# Altium project PropMark.PrjPcb
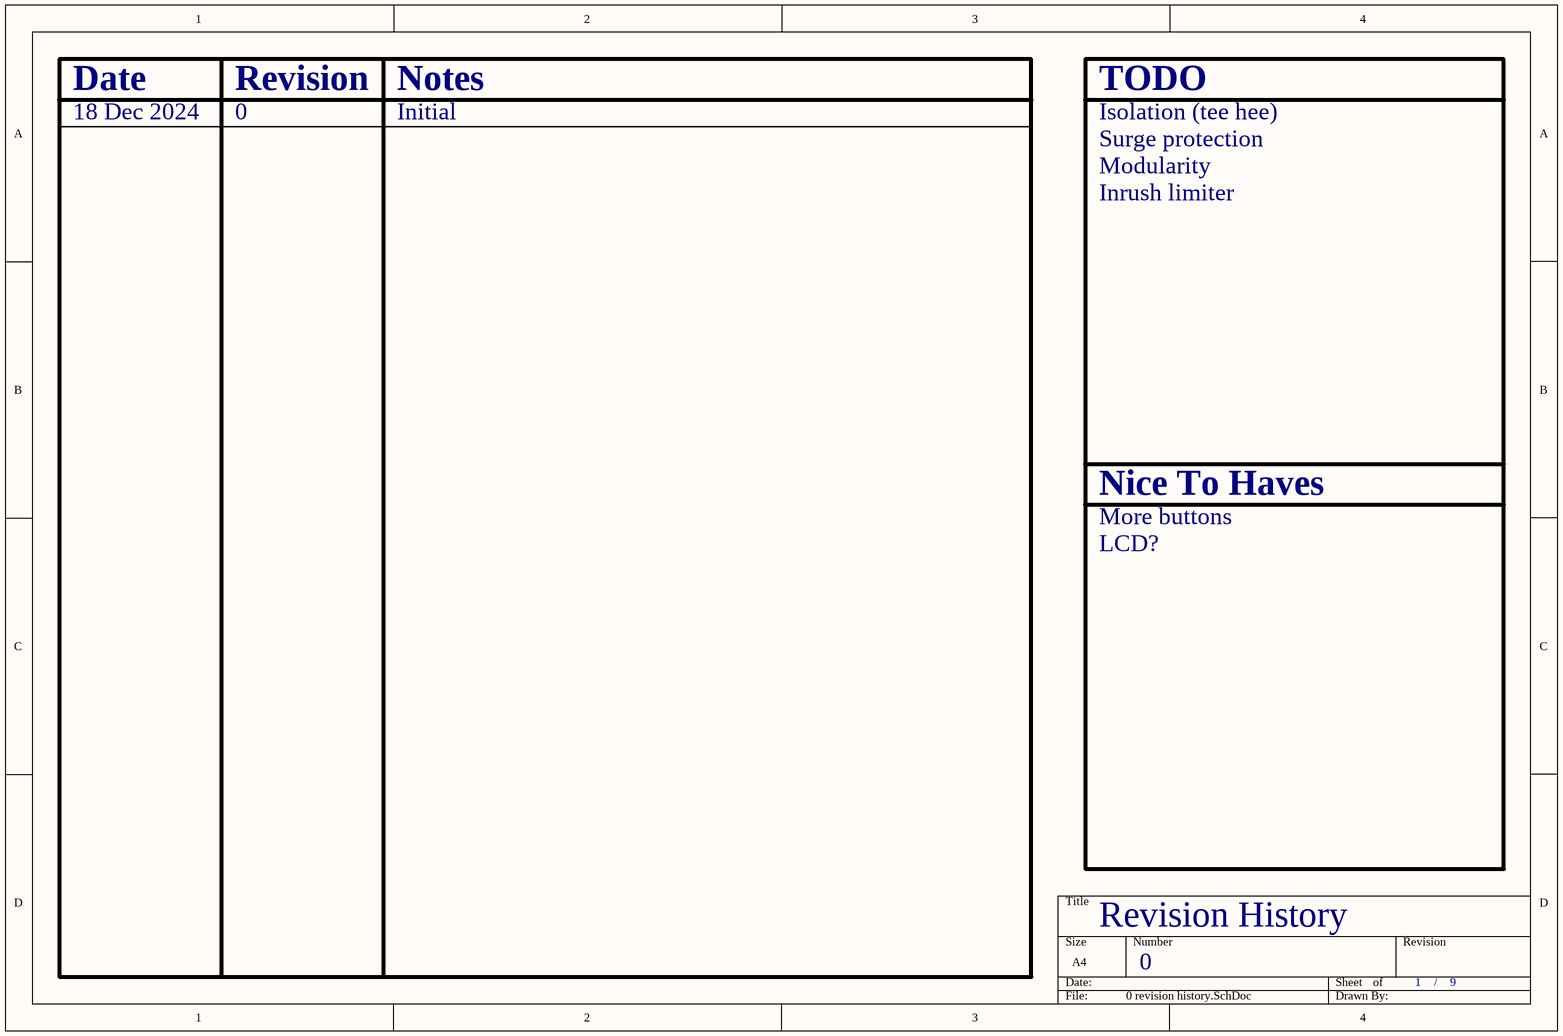
[diagram p0: 0 revision history.SchDoc]
8 sheets, 173 parts. Net scope: hierarchical (ports join the sheet entries above them; power ports are global).
Board files: main.PcbDoc, panel.PcbDoc
Sheets:
  0 revision history.SchDoc
  1 power.SchDoc
  2 main mcu.SchDoc
  3 ports.SchDoc
  4 memory.SchDoc
  5 led.SchDoc
  6 cell amplifier.SchDoc
  7 esc.SchDoc

## Sheet 0 revision history.SchDoc
size A4; DocumentNumber: 0; SheetNumber: 1; SheetTotal: 9

### Notes on the sheet
- Date
- Revision
- Notes
- TODO
- 18 Dec 2024
- 0
- Initial
- Isolation (tee hee)
- Surge protection
- Modularity
- Inrush limiter
- Nice To Haves
- More buttons
- LCD?
- Revision History
- /

## Sheet 1 power.SchDoc
size A4; DocumentNumber: 1; SheetNumber: 3; SheetTotal: 9
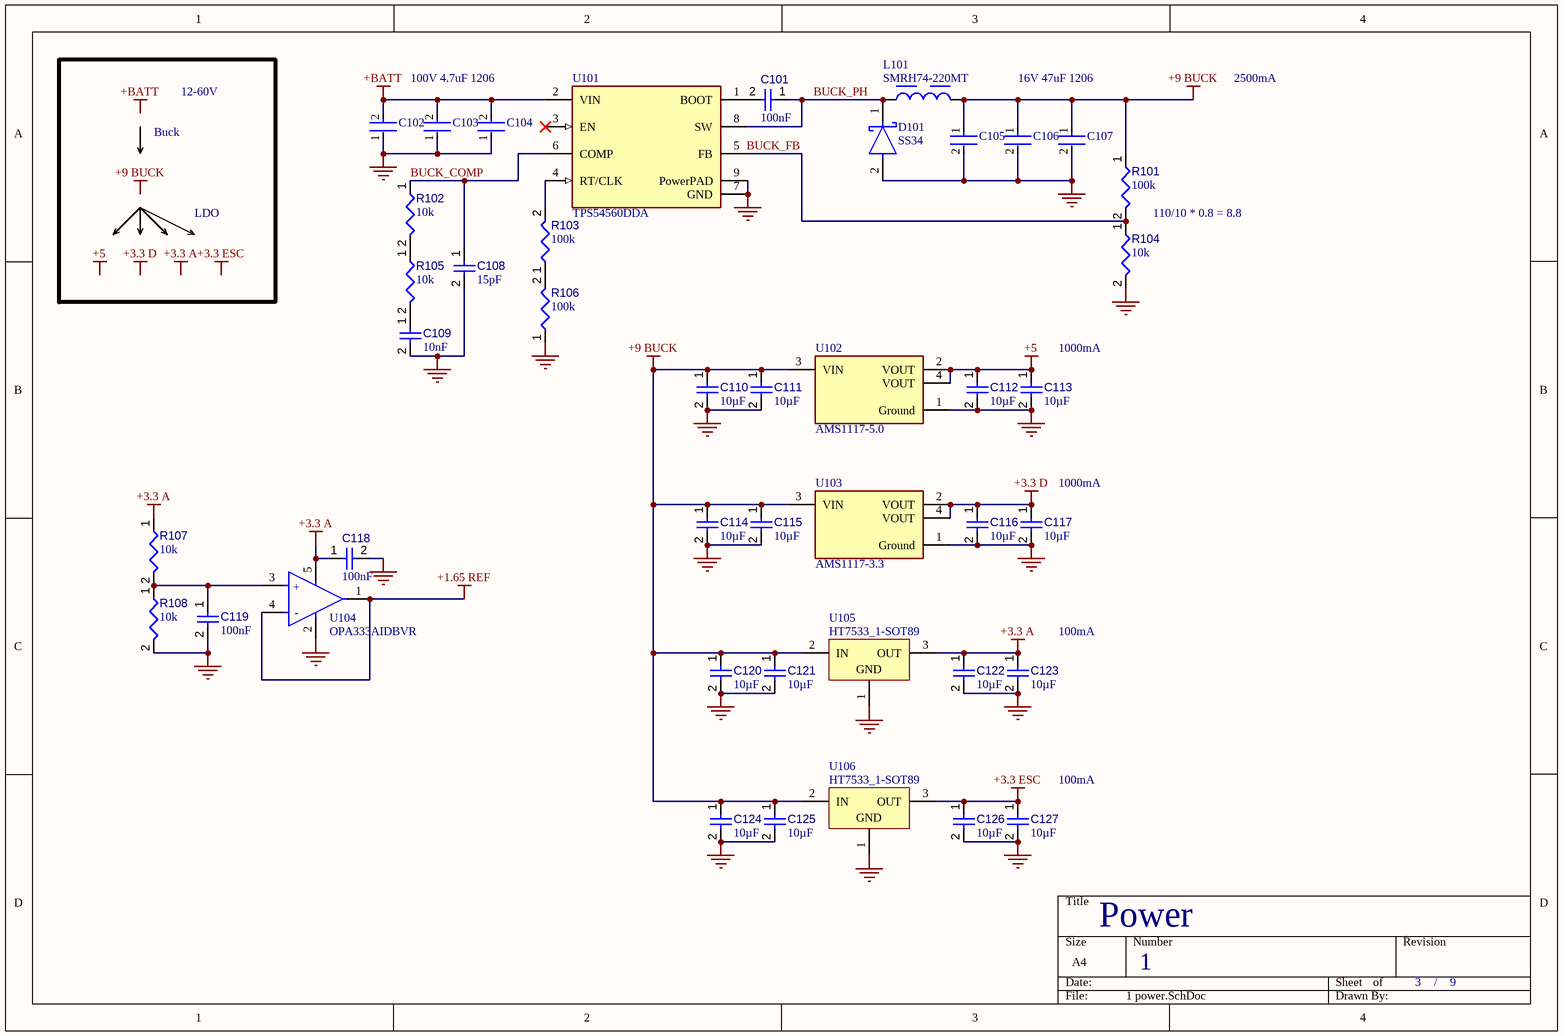
[diagram p1: 1 power.SchDoc]

### Parts
C101  value 100nF  [CAPC0402(1005)60_L]  (hidden comment: Capacitor 100nF +/-20% 25V 0402)
C102  GRM31CZ72A475KE11L  [FP-GRM31C-0_3-e0_3_0_9-MFG]  (value not drawn)
C103  GRM31CZ72A475KE11L  [FP-GRM31C-0_3-e0_3_0_9-MFG]  (value not drawn)
C104  GRM31CZ72A475KE11L  [FP-GRM31C-0_3-e0_3_0_9-MFG]  (value not drawn)
C105  C3216X5R1C476M160AB  [FP-C3216-160-0_2-MFG]  (value not drawn)
C106  C3216X5R1C476M160AB  [FP-C3216-160-0_2-MFG]  (value not drawn)
C107  C3216X5R1C476M160AB  [FP-C3216-160-0_2-MFG]  (value not drawn)
C108  value 15pF  [CAPC0402(1005)60_L]  (hidden comment: Capacitor 15pF +/-20% 50V 0402)
C109  value 10nF  [CAPC0402(1005)60_L]  (hidden comment: Capacitor 10nF +/-20% 50V 0402)
C110  value 10µF  [CAPC0603(1608)100_L]  (hidden comment: Capacitor 10µF +/-20% 10V 0603)
C111  value 10µF  [CAPC0603(1608)100_L]  (hidden comment: Capacitor 10µF +/-20% 10V 0603)
C112  value 10µF  [CAPC0603(1608)100_L]  (hidden comment: Capacitor 10µF +/-20% 10V 0603)
C113  value 10µF  [CAPC0603(1608)100_L]  (hidden comment: Capacitor 10µF +/-20% 10V 0603)
C114  value 10µF  [CAPC0603(1608)100_L]  (hidden comment: Capacitor 10µF +/-20% 10V 0603)
C115  value 10µF  [CAPC0603(1608)100_L]  (hidden comment: Capacitor 10µF +/-20% 10V 0603)
C116  value 10µF  [CAPC0603(1608)100_L]  (hidden comment: Capacitor 10µF +/-20% 10V 0603)
C117  value 10µF  [CAPC0603(1608)100_L]  (hidden comment: Capacitor 10µF +/-20% 10V 0603)
C118  value 100nF  [CAPC0402(1005)60_L]  (hidden comment: Capacitor 100nF +/-20% 25V 0402)
C119  value 100nF  [CAPC0402(1005)60_L]  (hidden comment: Capacitor 100nF +/-20% 25V 0402)
C120  value 10µF  [CAPC0603(1608)100_L]  (hidden comment: Capacitor 10µF +/-20% 10V 0603)
C121  value 10µF  [CAPC0603(1608)100_L]  (hidden comment: Capacitor 10µF +/-20% 10V 0603)
C122  value 10µF  [CAPC0603(1608)100_L]  (hidden comment: Capacitor 10µF +/-20% 10V 0603)
C123  value 10µF  [CAPC0603(1608)100_L]  (hidden comment: Capacitor 10µF +/-20% 10V 0603)
C124  value 10µF  [CAPC0603(1608)100_L]  (hidden comment: Capacitor 10µF +/-20% 10V 0603)
C125  value 10µF  [CAPC0603(1608)100_L]  (hidden comment: Capacitor 10µF +/-20% 10V 0603)
C126  value 10µF  [CAPC0603(1608)100_L]  (hidden comment: Capacitor 10µF +/-20% 10V 0603)
C127  value 10µF  [CAPC0603(1608)100_L]  (hidden comment: Capacitor 10µF +/-20% 10V 0603)
D101  SS34  [FP-SMA-MFG]
L101  SMRH74-220MT  [WE-HCI_7040]
R101  value 100k  [RESC0402(1005)_L]  (hidden comment: Resistor 100K +/-1 % 0402 63 mW)
R102  value 10k  [RESC0402(1005)_L]  (hidden comment: Resistor 10K  +/-1 % 0402 63 mW)
R103  value 100k  [RESC0402(1005)_L]  (hidden comment: Resistor 100K +/-1 % 0402 63 mW)
R104  value 10k  [RESC0402(1005)_L]  (hidden comment: Resistor 10K  +/-1 % 0402 63 mW)
R105  value 10k  [RESC0402(1005)_L]  (hidden comment: Resistor 10K  +/-1 % 0402 63 mW)
R106  value 100k  [RESC0402(1005)_L]  (hidden comment: Resistor 100K +/-1 % 0402 63 mW)
R107  value 10k  [RESC0402(1005)_L]  (hidden comment: Resistor 10K  +/-1 % 0402 63 mW)
R108  value 10k  [RESC0402(1005)_L]  (hidden comment: Resistor 10K  +/-1 % 0402 63 mW)
U101  TPS54560DDA  [FP-DDA0008E-IPC_C]
U102  AMS1117-5.0  [FP-AMS1117-IPC_C]
U103  AMS1117-3.3  [FP-AMS1117-IPC_C]
U104  OPA333AIDBVR  [FP-DBV0005A-MFG]
U105  HT7533_1-SOT89  [SOT89_L]
U106  HT7533_1-SOT89  [SOT89_L]

### Nets
+1.65 REF: U104.1(OUT) U104.4(-IN)
+3.3 A: C118.1 C122.1 C123.1 R107.1 U104.5(V+) U105.3(OUT)
+3.3 D: C116.1 C117.1 U103.2(VOUT) U103.4(VOUT)
+3.3 ESC: C126.1 C127.1 U106.3(OUT)
+5: C112.1 C113.1 U102.2(VOUT) U102.4(VOUT)
+9 BUCK: C105.1 C106.1 C107.1 C110.1 C111.1 C114.1 C115.1 C120.1 C121.1 C124.1 C125.1 L101.2 R101.1 U102.3(VIN) U103.3(VIN) U105.2(IN) U106.2(IN)
+BATT: C102.2 C103.2 C104.2 U101.2(VIN)
GND: C102.1 C103.1 C104.1 C105.2 C106.2 C107.2 C108.2 C109.2 C110.2 C111.2 C112.2 C113.2 C114.2 C115.2 C116.2 C117.2 C118.2 C119.2 C120.2 C121.2 C122.2 C123.2 C124.2 C125.2 C126.2 C127.2 D101.2(A) R104.2 R106.1 R108.2 U101.7(GND) U101.9(PowerPAD) U102.1(Ground) U103.1(Ground) U104.2(V-) U105.1(GND) U106.1(GND)
BUCK_COMP: C108.1 R102.1 U101.6(COMP)
BUCK_FB: R101.2 R104.1 U101.5(FB)
BUCK_PH: C101.1 D101.1(C) L101.1 U101.8(SW)
NetC101_2: C101.2 U101.1(BOOT)
NetC109_1: C109.1 R105.2
NetC119_1: C119.1 R107.2 R108.1 U104.3(+IN)
NetR102_2: R102.2 R105.1
NetR103_1: R103.1 R106.2
NetR103_2: R103.2 U101.4(RT/CLK)

Not connected (* = marked no-connect by the designer): U101 3(EN)*

### Notes on the sheet
- 12-60V
- 100V 4.7uF 1206
- 16V 47uF 1206
- 2500mA
- Buck
- LDO
- 110/10 * 0.8 = 8.8
- (near C113) 1000mA
- (near C117) 1000mA
- (near C123) 100mA
- (near C127) 100mA
- Power
- /
- Labels drawn without touching a wire or pin: +3.3 A, +3.3 D, +3.3 ESC, +5, +9 BUCK, +BATT
- (in symbol CMP-0272-00862-4) +; -

### Library data of the parts
C101 C118 C119 = CMP-001-00065-4: Chip Capacitor, 100nF +/-20%, 25V, 0402, Thickness 0.6 mm; Tolerance: 10%; Max Operating Temperature: 85°C; Min Operating Temperature: -55°C; Pins: 2; Voltage Rating: 25V; Mounting Technology: SMT; Case/Package: 0402
C102-C104 = CMP-06035-056253-1: Chip Multilayer Ceramic Capacitors for General Purpose, 1206, 4.7uF, X7R, 15%, 10%, 100V
C105-C107 = CMP-2000-07442-2: Multilayer Ceramic Capacitors 47uF ±20% 16V X5R SMD 1206; Resistor Type: Ceramic; Width: 0.063inch; Case Code (Imperial): 1206; Radiation Hardening: No; Thickness: 0.071inch; Dielectric: X5R; Weight: 0.000571oz; Termination: SMD/SMT; Dielectric Material: Ceramic; Min Operating Temperature: -55°C; Depth: 1.6mm; Case Code (Metric): 3216; Max Operating Temperature: 85°C; RoHS Compliant: Yes; REACH SVHC: No SVHC; Mount: Surface Mount; Lead Free: Lead Free; Height: 1.6mm; Length: 3.2mm; Tolerance: 20%; Voltage Rating (DC): 16V; Capacitance: 47uF; Package Quantity: 1; Construction: Flat; Packaging: Tape and Reel; Series: C; Case/Package: 1206; Voltage Rating: 16V
C108 = CMP-001-00069-3: Chip Capacitor, 15pF +/-20%, 50V, 0402, Thickness 0.6 mm; Tolerance: 5%; Max Operating Temperature: 85°C; Pins: 2; Case/Package: 0402; Voltage Rating: 50V; Min Operating Temperature: -55°C; Mounting Technology: SMT; JLCPCB Part #: C1548
C109 = CMP-001-00069-3: Chip Capacitor, 10nF +/-20%, 50V, 0402, Thickness 0.6 mm; Tolerance: 5%; Max Operating Temperature: 85°C; Pins: 2; Case/Package: 0402; Voltage Rating: 50V; Min Operating Temperature: -55°C; Mounting Technology: SMT; JLCPCB Part #: C15195
C110-C117 C120-C127 = CMP-001-00075-4: Chip Capacitor, 10µF +/-20%, 10V, 0603, Thickness 1 mm; Tolerance: 10%; Voltage Rating: 10V; Max Operating Temperature: 85°C; Pins: 2; Case/Package: 0603; Mounting Technology: SMT; Min Operating Temperature: -55°C
D101 = CMP-1667-00003-3: DIODE SCHOTTKY 40V 3A SMA; Max Forward Surge Current (Ifsm): 80A; Forward Voltage: 500mV; Polarity: Standard; Max Reverse Current: 500uA; Capacitance: 250pF; Element Configuration: Single; Mount: Surface Mount; Output Current: 3A; Radiation Hardening: No; Width: 2.92mm; Current Rating: 3A; Termination: SMD/SMT; Voltage: 40V; Series: -; Max Operating Temperature: 125°C; Current: 3A; Max Repetitive Reverse Voltage (Vrrm): 40V; Min Operating Temperature: -55°C; REACH SVHC: No SVHC; Number of Pins: 2; Average Rectified Current: 3A; Contact Plating: Tin; RoHS Compliant: Yes; Max Reverse Voltage (DC): 40V; Packaging: Tape and Reel; Height: 2.3mm; Length: 4.6mm; Case/Package: SMA; Weight: 0.002258oz; Peak Non-Repetitive Surge Current: 80A; Package Quantity: 5000; Lead Free: Lead Free; Forward Current: 3A; Voltage Rating (DC): 40V
L101 = CMP-0226-00071-2: NexarPartId: 7864301; Max DC Current: 6A; Series Resistance: 19.5Ω; Shielding: Shielded; DC Resistance (DCR): 19.5mΩ; Inductance: 4.7µH; Tolerance: 20%; Test Frequency: 100kHz; Self Resonant Frequency: 33MHz; Saturation Current: 7A; Height - Seated (Max): 3.9878mm; Height: 3.8mm; Packaging: Cut Tape (CT); REACH SVHC: Unknown; Width: 6.9mm; Mount: Surface Mount; Termination: SMD/SMT; Composition: Wirewound; Depth: 6.9mm; Ambient Temperature Range High: 100°C; Lead Free: Lead Free; Current Rating: 6A; Length: 7mm; RMS Current (Irms): 6A; Ambient Temperature Range Low: -40°C; Number of Pins: 2; Case/Package: Nonstandard; Min Operating Temperature: -40°C; RoHS: Compliant; Resistance: 19.5mΩ; Max Operating Temperature: 150°C; Inductance Tolerance: 20%
R101 R103 R106 = CMP-009-00168-3: Chip Resistor, 100 kOhms, +/-1 %, 63 mW, -55 to 155 degC, 0402; Tolerance: 1%; Power: 63mW; Max Operating Temperature: 155°C; Min Operating Temperature: -55°C; Pins: 2; Case/Package: 0402
R102 R104 R105 R107 R108 = CMP-009-00149-3: Chip Resistor, 10 kOhms, +/-1 %, 63 mW, -55 to 125 degC, 0402; Power: 63mW; Tolerance: 1%; Min Operating Temperature: -55°C; Case/Package: 0402; Max Operating Temperature: 155°C; Pins: 2
U101 = CMP-04918-000033-1: IC REG BCK SPLIT RAIL ADJ 8SOPWR; Manufacturer: Texas Instruments; Min Supply Voltage: 4.5V; Switching Topology: Buck; Max Junction Temp: +150°C; Max Duty Cycle: 100%; Standoff Height: 0mm; Output Type: AdjustableProgrammable; Output Voltage: 0.8-58.8V; Output Current: 5A; Number Of Outputs: 1; Switching Frequency: 100-2500kHz; Max Supply Voltage: 60V; Nominal Supply Current: 146uA; Octopart: https://octopart.com/tps54560dda-texas+instruments-26977150; Temperature: -40°C to +125°C; ComponentLink2Description: Datasheet; Category: IC; Mouser Description: Voltage Regulators - Switching Regulators 60V Input 5 A SD DC-DC Cnvtr; Automotive: No; Ipc Land Pattern Name: SOIC127P600X170-8; Height: 1.7mm; RoHS: TRUE; ComponentLink2URL: http://www.ti.com/lit/ds/symlink/tps54560.pdf; Device Class L3: Voltage Regulators - Switching; Temperature Range High: +125°C; Device Class L2: Power Management ICs; Package: DDA0008E; Lead Free: Yes; Digikey Description: IC REG BCK SPLIT RAIL ADJ 8SOPWR; Device Class L1: Integrated Circuits (ICs); Manufacturer Part Number: TPS54560DDA; Temperature Range Low: -40°C
U102 = CMP-209535-000001-1: LDO Voltage Regulators 1A, 5.0V; Manufacturer: Advanced Monolithic Systems; Dropout Voltage: 1.1V; Output Type: Fixed; Nominal Supply Current: 5mA; Output Voltage: 3.3V; Max Power Dissipation: 1.2W; Max Supply Voltage: 15V; Number Of Outputs: 1; Standoff Height: 0.64mm; Max Junction Temp: +125°C; Height: 1.8mm; Package: AMS1117; Device Class L2: Power Management ICs; ComponentLink2Description: Datasheet; ComponentLink2URL: http://www.advanced-monolithic.com/pdf/ds1117.pdf; Category: IC; RoHS: TRUE; Automotive: No; Device Class L1: Integrated Circuits (ICs); Output Current: 1A; Device Class L3: Voltage Regulators - Linear; Temperature: -40°C to +125°C; Manufacturer Part Number: AMS1117-5.0; Temperature Range Low: -40°C; Lead Free: Yes; Ipc Land Pattern Name: SOT229P700X180-4; Temperature Range High: +125°C; JLCPCB Part #: C6187
U103 = CMP-209535-000001-1: LDO Voltage Regulators 1A, 3.3V; Manufacturer: Advanced Monolithic Systems; Dropout Voltage: 1.1V; Output Type: Fixed; Nominal Supply Current: 5mA; Max Power Dissipation: 1.2W; Max Supply Voltage: 15V; Number Of Outputs: 1; Standoff Height: 0.64mm; Max Junction Temp: +125°C; Height: 1.8mm; Package: AMS1117; Device Class L2: Power Management ICs; ComponentLink2Description: Datasheet; ComponentLink2URL: http://www.advanced-monolithic.com/pdf/ds1117.pdf; Category: IC; RoHS: TRUE; Automotive: No; Device Class L1: Integrated Circuits (ICs); Output Current: 1A; Device Class L3: Voltage Regulators - Linear; Temperature: -40°C to +125°C; Output Voltage: 3.3V; Manufacturer Part Number: AMS1117-3.3; Temperature Range Low: -40°C; Octopart: https://octopart.com/ams1117-3.3-advanced+monolithic+systems-25899300; Lead Free: Yes; Ipc Land Pattern Name: SOT229P700X180-4; Temperature Range High: +125°C; JLCPCB Part #: C6186
U104 = CMP-0272-00862-4: IC OPAMP ZER-DRIFT 1CIRC SOT23-5; Number of Elements: 1; Common Mode Rejection Ratio: 106dB; Max Supply Voltage: 5.5V; Min Supply Voltage: 1.8V; Max I/O Voltage: 10uV; Output Current per Channel: 5mA; Max Dual Supply Voltage: 2.75V; Operating Supply Current: 17uA; Nominal Supply Current: 25uA; Bandwidth: 350kHz; Min Dual Supply Voltage: 900mV; Power Supply Rejection Ratio (PSRR): 120dB; Voltage Gain: 130dB; Input Bias Current: 200pA; Slew Rate: 0.16V/µs; Number of Channels: 1; Max Operating Temperature: 125°C; REACH SVHC: No SVHC; Number of Amplifiers: 1; Input Offset Voltage (Vos): 10uV; Radiation Hardening: No; Lead Free: Lead Free; Operating Supply Voltage: 2.75V; Min Operating Temperature: -40°C; Contact Plating: Gold; Number of Pins: 5; Output Current: 5mA; Packaging: Tape and Reel; Unity Gain Bandwidth Product: 350kHz; Number of Circuits: 1; Gain Bandwidth Product: 350kHz; Case/Package: SOT-23-5; Package Quantity: 1
U105 U106 = CMP-0204-00101-1: 100mA Low Power LDO, Output Voltage 3.3V, SOT89 Pkg; DatasheetVersion: Rev1.80, Mar-2010; PackageDescription: 3-Pin SOT-89 Package 1.5 mm Pitch, 4.1 mm Lead Span; PackageReference: SOT89; PackageVersion: May-2010; Code_IPC: SOT89

## Sheet 2 main mcu.SchDoc
size A4; DocumentNumber: 2; SheetNumber: 4; SheetTotal: 9
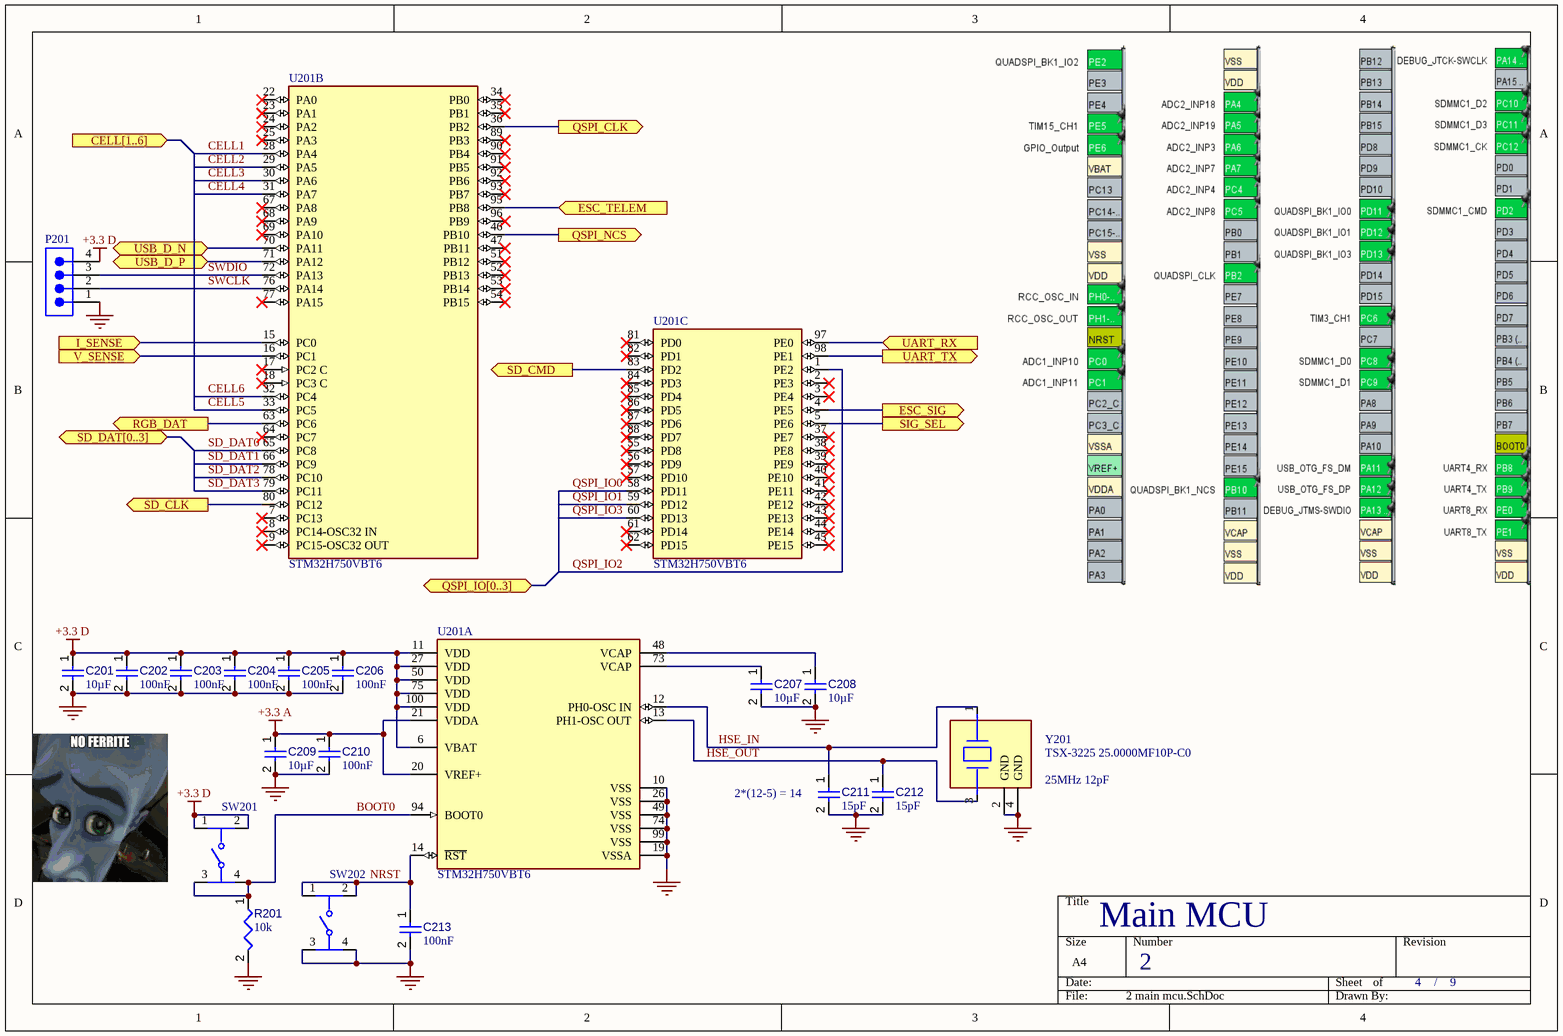
[diagram p2: 2 main mcu.SchDoc]

### Parts
C201  value 10µF  [CAPC0603(1608)100_L]  (hidden comment: Capacitor 10µF +/-20% 10V 0603)
C202  value 100nF  [CAPC0402(1005)60_L]  (hidden comment: Capacitor 100nF +/-20% 25V 0402)
C203  value 100nF  [CAPC0402(1005)60_L]  (hidden comment: Capacitor 100nF +/-20% 25V 0402)
C204  value 100nF  [CAPC0402(1005)60_L]  (hidden comment: Capacitor 100nF +/-20% 25V 0402)
C205  value 100nF  [CAPC0402(1005)60_L]  (hidden comment: Capacitor 100nF +/-20% 25V 0402)
C206  value 100nF  [CAPC0402(1005)60_L]  (hidden comment: Capacitor 100nF +/-20% 25V 0402)
C207  value 10µF  [CAPC0603(1608)100_L]  (hidden comment: Capacitor 10µF +/-20% 10V 0603)
C208  value 10µF  [CAPC0603(1608)100_L]  (hidden comment: Capacitor 10µF +/-20% 10V 0603)
C209  value 10µF  [CAPC0603(1608)100_L]  (hidden comment: Capacitor 10µF +/-20% 10V 0603)
C210  value 100nF  [CAPC0402(1005)60_L]  (hidden comment: Capacitor 100nF +/-20% 25V 0402)
C211  value 15pF  [CAPC0402(1005)60_L]  (hidden comment: Capacitor 15pF +/-20% 50V 0402)
C212  value 15pF  [CAPC0402(1005)60_L]  (hidden comment: Capacitor 15pF +/-20% 50V 0402)
C213  value 100nF  [CAPC0402(1005)60_L]  (hidden comment: Capacitor 100nF +/-20% 25V 0402)
P201  61300411121  [61300411121]  (value not drawn)
R201  value 10k  [RESC0402(1005)_L]  (hidden comment: Resistor 10K  +/-1 % 0402 63 mW)
SW201  PTS810SJM250SMTRLFS  [FP-PTS810SJM250SMTRLFS-MFG]  (value not drawn)
SW202  PTS810SJM250SMTRLFS  [FP-PTS810SJM250SMTRLFS-MFG]  (value not drawn)
U201  STM32H750VBT6  [FP-LQFP100-1L-MFG]  (parts A,B,C of 3)
Y201  TSX-3225 25.0000MF10P-C0  [FP-TSX-3225-MFG]

### Ports
CELL[1..6] (in), ESC_SIG (out), ESC_TELEM (in), I_SENSE (in), QSPI_CLK (out), QSPI_IO[0..3] (bidir), QSPI_NCS (out), RGB_DAT (out), SD_CLK (out), SD_CMD (out), SD_DAT[0..3] (bidir), SIG_SEL (out), UART_RX (in), UART_TX (out), USB_D_N (bidir), USB_D_P (bidir), V_SENSE (in)

### Nets
+3.3 A: C209.1 C210.1 U201.20(VREF+) U201.21(VDDA)
+3.3 D: C201.1 C202.1 C203.1 C204.1 C205.1 C206.1 P201.4 SW201.1 SW201.2 U201.6(VBAT) U201.11(VDD) U201.27(VDD) U201.50(VDD) U201.75(VDD) U201.100(VDD)
GND: C201.2 C202.2 C203.2 C204.2 C205.2 C206.2 C207.2 C208.2 C209.2 C210.2 C211.2 C212.2 C213.2 P201.1 R201.2 SW202.3 SW202.4 U201.10(VSS) U201.19(VSSA) U201.26(VSS) U201.49(VSS) U201.74(VSS) U201.99(VSS) Y201.2(GND) Y201.4(GND)
BOOT0: R201.1 SW201.3 SW201.4 U201.94(BOOT0)
CELL1: U201.28(PA4)
CELL2: U201.29(PA5)
CELL3: U201.30(PA6)
CELL4: U201.31(PA7)
CELL5: U201.33(PC5)
CELL6: U201.32(PC4)
HSE_IN: C211.1 U201.12(PH0-OSC_IN) Y201.1
HSE_OUT: C212.1 U201.13(PH1-OSC_OUT) Y201.3
NRST: C213.1 SW202.1 SW202.2 U201.14(~{RST})
QSPI_IO0: U201.58(PD11)
QSPI_IO1: U201.59(PD12)
QSPI_IO2: U201.1(PE2)
QSPI_IO3: U201.60(PD13)
SD_DAT0: U201.65(PC8)
SD_DAT1: U201.66(PC9)
SD_DAT2: U201.78(PC10)
SD_DAT3: U201.79(PC11)
SWCLK: P201.2 U201.76(PA14)
SWDIO: P201.3 U201.72(PA13)
NetC207_1: C207.1 U201.73(VCAP)
NetC208_1: C208.1 U201.48(VCAP)
NetU201_4: U201.4(PE5) ; port ESC_SIG
NetU201_5: U201.5(PE6) ; port SIG_SEL
NetU201_15: U201.15(PC0) ; port I_SENSE
NetU201_16: U201.16(PC1) ; port V_SENSE
NetU201_36: U201.36(PB2) ; port QSPI_CLK
NetU201_46: U201.46(PB10) ; port QSPI_NCS
NetU201_63: U201.63(PC6) ; port RGB_DAT
NetU201_70: U201.70(PA11) ; port USB_D_N
NetU201_71: U201.71(PA12) ; port USB_D_P
NetU201_80: U201.80(PC12) ; port SD_CLK
NetU201_83: U201.83(PD2) ; port SD_CMD
NetU201_95: U201.95(PB8) ; port ESC_TELEM
NetU201_97: U201.97(PE0) ; port UART_RX
NetU201_98: U201.98(PE1) ; port UART_TX

Not connected (* = marked no-connect by the designer): U201 2(PE3)* 3(PE4)* 7(PC13)* 8(PC14-OSC32_IN)* 9(PC15-OSC32_OUT)* 17(PC2_C)* 18(PC3_C)* 22(PA0)* 23(PA1)* 24(PA2)* 25(PA3)* 34(PB0)* 35(PB1)* 37(PE7)* 38(PE8)* 39(PE9)* 40(PE10)* 41(PE11)* 42(PE12)* 43(PE13)* 44(PE14)* 45(PE15)* 47(PB11)* 51(PB12)* 52(PB13)* 53(PB14)* 54(PB15)* 55(PD8)* 56(PD9)* 57(PD10)* 61(PD14)* 62(PD15)* 64(PC7)* 67(PA8)* 68(PA9)* 69(PA10)* 77(PA15)* 81(PD0)* 82(PD1)* 84(PD3)* 85(PD4)* 86(PD5)* 87(PD6)* 88(PD7)* 89(PB3)* 90(PB4)* 91(PB5)* 92(PB6)* 93(PB7)* 96(PB9)*

### Notes on the sheet
- (near Y201) 25MHz 12pF
- (near C211) 2*(12-5) = 14
- Main MCU
- /

### Library data of the parts
C201 C207-C209 = CMP-001-00075-4: as C110 on sheet 1 power; Voltage Rating: 10V; Max Operating Temperature: 85°C; Pins: 2; Case/Package: 0603; Mounting Technology: SMT; Min Operating Temperature: -55°C
C202-C206 C210 C213 = CMP-001-00065-4: as C101 on sheet 1 power; Max Operating Temperature: 85°C; Min Operating Temperature: -55°C; Pins: 2; Voltage Rating: 25V; Mounting Technology: SMT; Case/Package: 0402
C211 C212 = CMP-001-00069-3: as C108 on sheet 1 power; Max Operating Temperature: 85°C; Pins: 2; Case/Package: 0402; Voltage Rating: 50V; Min Operating Temperature: -55°C; Mounting Technology: SMT; JLCPCB Part #: C1548
P201 = CMP-1502-01064-3: NexarPartId: 32855522; Operating Supply Voltage: 250V; Pitch: 2.54mm; Contact Resistance: 20mΩ; Number of Positions: 4; Current Rating: 3A; Connector Type: Male Pin; Gender: Male; Contact Plating: Gold; Height: 8.89mm; Lead Pitch: 2.54mm; Lead Free: Lead Free; Contact Mating Length: 5.9944mm; Number of Rows: 1; Termination: Solder; Packaging: Bulk; REACH SVHC: Unknown; Min Operating Temperature: -40°C; RoHS: Compliant; Number of Contacts: 4; Voltage Rating: 250V; Color: Black; Max Operating Temperature: 105°C; Contact Material: Copper; Mount: Through Hole; Orientation: Vertical; Number of Pins: 4
R201 = CMP-009-00149-3: as R102 on sheet 1 power; Min Operating Temperature: -55°C; Case/Package: 0402; Max Operating Temperature: 155°C; Pins: 2
SW201 SW202 = CMP-10040-000001-2: SWITCH TACTILE SPST-NO 0.05A 16V; Throw Configuration: SPST; Operating Force: 160gf; Actuator Type: Standard; Switch Travel: 0.15mm; Switch Function: Off-Mom; Max Current Rating: 50mA; Mechanical Life: 150000Cycles; Illumination Type: Non-Illuminated; Package Quantity: 2900; Depth: 4.6mm; Mount: Surface Mount; Packaging: Tape and Reel; Length: 3.2mm; RoHS Compliant: Yes; Case/Package: SMD/SMT; Voltage Rating (DC): 16V; Min Operating Temperature: -40°C; Termination: J-Bend; Lead Free: Lead Free; Contact Plating: Silver; Orientation: Straight; Max Operating Temperature: 85°C; Current Rating: 50mA; Color: Black
U201 = CMP-12105-000017-1: IC MCU 32BIT 128KB FLASH 100LQFP; Manufacturer: STMicroelectronics; Number Of Uart Channels: 9; Number Of I/Os: 82; Max Junction Temp: +125°C; Data Bus Width: 32bits; Ram Size: 1MBytes; Min Supply Voltage: 1.62V; Number Of Spi Channels: 6; Number Of Adc Channels: 36; Max Supply Voltage: 3.6V; Standoff Height: 0.05mm; Interface: I2C,SPI,UART,USART,CAN,USB,LIN,IrDA,Ethernet,I2S,Other; Number Of A/D Converters: 3; Number Of I2C Channels: 4; Memory Size: 128KBytes; Frequency: 480MHz; Number Of Timers/Counters: 20; Number Of Ethernet Channels: 1; Core Architecture: ARM Cortex-M7; Number Of Usb Channels: 2; Number Of Pwm Channels: 42; Ambient Temperature Range High: +85°C; Temperature: -40°C to +125°C; ComponentLink2URL: https://www.st.com/resource/en/datasheet/stm32h750vb.pdf; Device Class L2: Embedded Processors and Controllers; Temperature Range Low: -40°C; Octopart: https://octopart.com/stm32h750vbt6-stmicroelectronics-94048547; Category: IC; Manufacturer Part Number: STM32H750VBT6; Height: 1.6mm; Lead Free: Yes; Device Class L1: Integrated Circuits (ICs); Digikey Description: IC MCU 32BIT 128KB FLASH 100LQFP; RoHS: TRUE; Ambient Temperature Range Low: -40°C; Device Class L3: Microcontrollers; ComponentLink2Description: Datasheet; Mouser Description: MCU 32-Bit STM32H750VB ARM Cortex M7 RISC 128KB Flash 1.8V/2.5V/3.3V 100-Pin LQFP Tray; Number Of Cores: 1; Automotive: No; Memory Type: FLASH; Package: LQFP100-1L; Temperature Range High: +125°C
Y201 = CMP-36405-000019-1: CRYSTAL 25.0000MHZ 18PF SMD; ESR (Equivalent Series Resistance): 40R; Frequency Stability: 10ppm; Frequency: 25MHz; Max Operating Temperature: 85°C; Length: 3.2mm; Packaging: Tape and Reel; Min Operating Temperature: -20°C; Depth: 2.5mm; Case/Package: SMD/SMT; Load Capacitance: 18pF; Number of Pins: 4

## Sheet 3 ports.SchDoc
size A4; DocumentNumber: 3; SheetNumber: 5; SheetTotal: 9
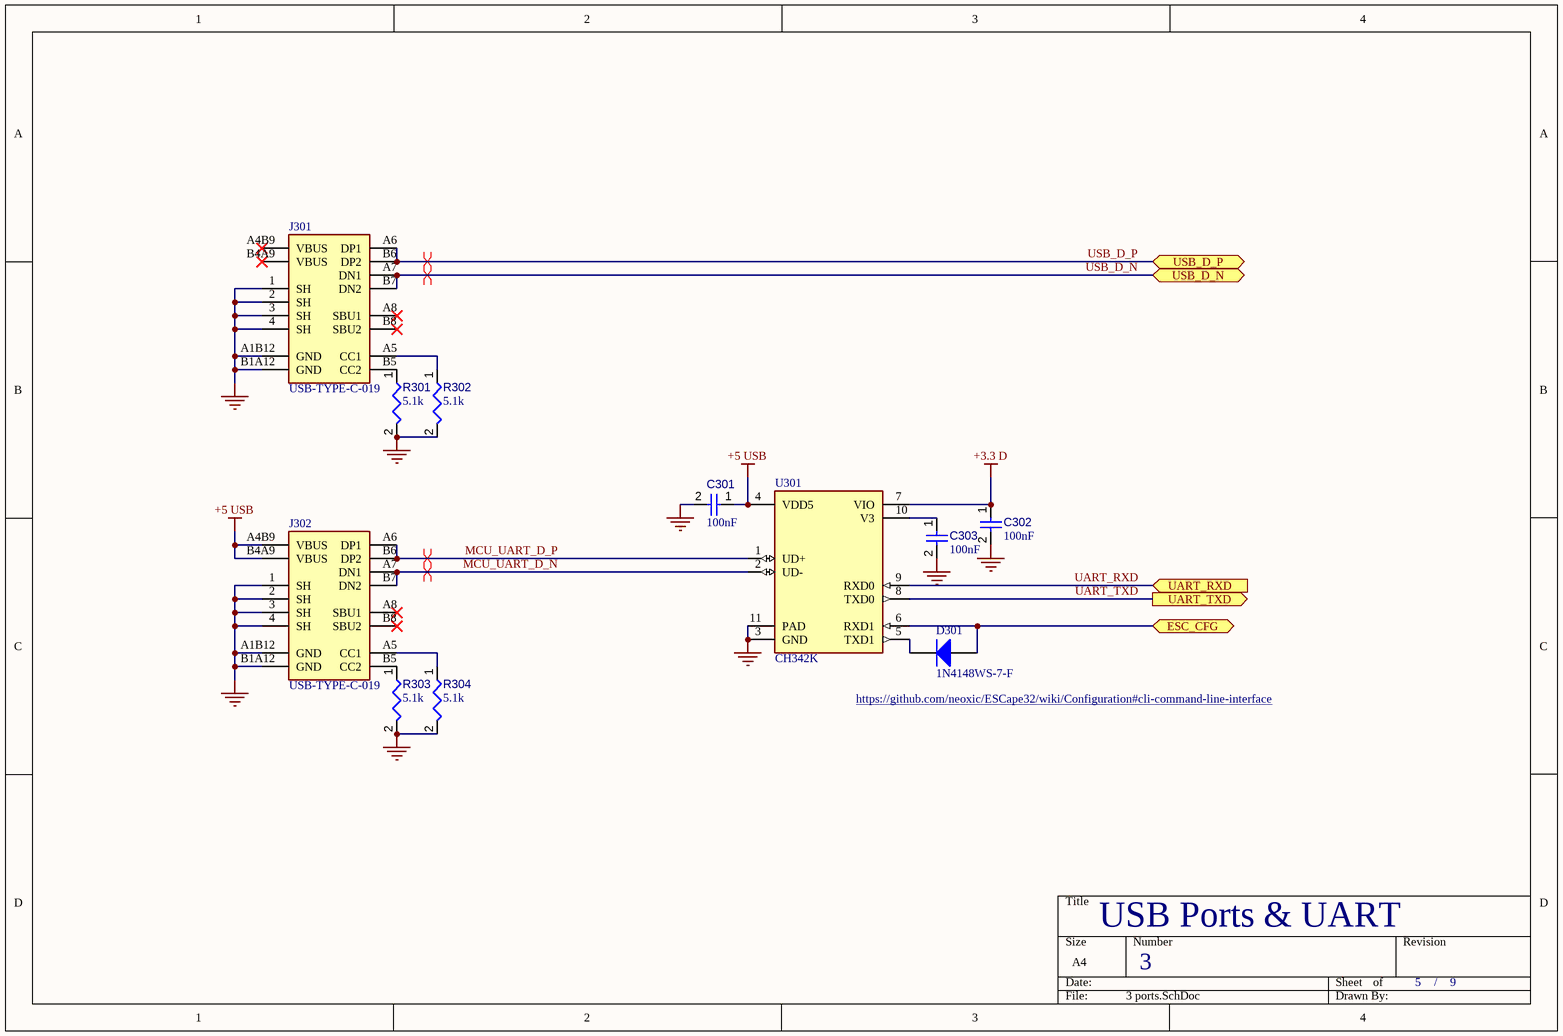
[diagram p3: 3 ports.SchDoc]

### Parts
C301  value 100nF  [CAPC0402(1005)60_L]  (hidden comment: Capacitor 100nF +/-20% 25V 0402)
C302  value 100nF  [CAPC0402(1005)60_L]  (hidden comment: Capacitor 100nF +/-20% 25V 0402)
C303  value 100nF  [CAPC0402(1005)60_L]  (hidden comment: Capacitor 100nF +/-20% 25V 0402)
D301  1N4148WS-7-F  [DIOD-SOD323-2-A_V]
J301  USB-TYPE-C-019  [USB-TYPE-C-12+4P]
J302  USB-TYPE-C-019  [USB-TYPE-C-12+4P]
R301  value 5.1k  [RESC0402(1005)_L]  (hidden comment: Resistor 5K1  +/-1 % 0402 63 mW)
R302  value 5.1k  [RESC0402(1005)_L]  (hidden comment: Resistor 5K1  +/-1 % 0402 63 mW)
R303  value 5.1k  [RESC0402(1005)_L]  (hidden comment: Resistor 5K1  +/-1 % 0402 63 mW)
R304  value 5.1k  [RESC0402(1005)_L]  (hidden comment: Resistor 5K1  +/-1 % 0402 63 mW)
U301  CH342K  [SSOP-10_L5.0-W3.9-P1.00-LS6.0-BL-EP]

### Ports
ESC_CFG (bidir), UART_RXD (in), UART_TXD (out), USB_D_N (bidir), USB_D_P (bidir)

### Nets
+3.3 D: C302.1 U301.7(VIO)
+5 USB: C301.1 J302.A4B9(VBUS) J302.B4A9(VBUS) U301.4(VDD5)
GND: C301.2 C302.2 C303.2 J301.1(SH) J301.2(SH) J301.3(SH) J301.4(SH) J301.A1B12(GND) J301.B1A12(GND) J302.1(SH) J302.2(SH) J302.3(SH) J302.4(SH) J302.A1B12(GND) J302.B1A12(GND) R301.2 R302.2 R303.2 R304.2 U301.3(GND) U301.11(PAD)
MCU_UART_D_N: J302.A7(DN1) J302.B7(DN2) U301.2(UD-)
MCU_UART_D_P: J302.A6(DP1) J302.B6(DP2) U301.1(UD+)
UART_RXD: U301.9(RXD0) ; port UART_RXD
UART_TXD: U301.8(TXD0) ; port UART_TXD
USB_D_N: J301.A7(DN1) J301.B7(DN2) ; port USB_D_N
USB_D_P: J301.A6(DP1) J301.B6(DP2) ; port USB_D_P
NetC303_1: C303.1 U301.10(V3)
NetD301_1: D301.1(A) U301.6(RXD1) ; port ESC_CFG
NetD301_2: D301.2(K) U301.5(TXD1)
NetJ301_A5: J301.A5(CC1) R302.1
NetJ301_B5: J301.B5(CC2) R301.1
NetJ302_A5: J302.A5(CC1) R304.1
NetJ302_B5: J302.B5(CC2) R303.1

Not connected (* = marked no-connect by the designer): J301 A4B9(VBUS)* A8(SBU1)* B4A9(VBUS)* B8(SBU2)*; J302 A8(SBU1)* B8(SBU2)*

### Layout directives
differential pair: MCU_UART_D_N, MCU_UART_D_P, USB_D_N, USB_D_P

### Notes on the sheet
- https://github.com/neoxic/ESCape32/wiki/Configuration#cli-command-line-interface
- USB Ports & UART
- /

### Library data of the parts
C301-C303 = CMP-001-00065-4: as C101 on sheet 1 power; Max Operating Temperature: 85°C; Min Operating Temperature: -55°C; Pins: 2; Voltage Rating: 25V; Mounting Technology: SMT; Case/Package: 0402
D301 = CMP-1667-00004-1: Fast Switching Diode, 75 V, 0.3 A, -65 to 150 degC, 2-Pin SOD323, RoHS, Tape and Reel; DatasheetVersion: Rev. 25-2, 03/2016; PackageDescription: 2-Pin Small Outline Diode, Body 1.7 x 1.3 mm; ComponentLink2Description: Datasheet; ComponentLink1URL: http://www.diodes.com/; PackageReference: SOD323-2; ComponentLink2URL: http://www.diodes.com/datasheets/ds30097.pdf; ComponentLink1Description: Manufacturer URL
J301 J302 = USB-TYPE-C-019: Connector Type:Type-C Standard:- Gender:Female Number of Contacts:16 Number of Ports:1 Mounting Style:Surface Mount Current Rating - Power (Max):3A Operating Temperature Range:-25℃~+85℃ Operating Temperature Range:-25℃~+85℃; Manufacturer: DEALON(德艺隆); Add into BOM: yes; Connector Type: Type-C; Gender: Female; Number of Contacts: 16; Number of Ports: 1; Current Rating - Power (Max): 3A; Symbol: USB-TYPE-C-019; Device: USB-TYPE-C-019; LCSC Part Name: Type-C 母座 卧贴; Supplier Part: C2927039; Manufacturer Part: USB-TYPE-C-019; Supplier Footprint: SMD; JLCPCB Part Class: Extended Part; Datasheet: https://atta.szlcsc.com/upload/public/pdf/source/20211217/CCD3D517E355E8E0CC52ABD8D5784AD8.pdf; Supplier: LCSC; Convert to PCB: yes; Standard: -; Mounting Style: Surface Mount; Operating Temperature Range: -25℃~+85℃
R301-R304 = CMP-009-00158-3: Chip Resistor, 5.1 kOhms, +/-1 %, 63 mW, -55 to 155 degC, 0402; Power: 63mW; Tolerance: 1%; Max Operating Temperature: 155°C; Pins: 2; Min Operating Temperature: -55°C; Case/Package: 0402
U301 = CH342K: ESSOP-10-150mil USB Converters ROHS

## Sheet 4 memory.SchDoc
size A4; DocumentNumber: 4; SheetNumber: 6; SheetTotal: 9
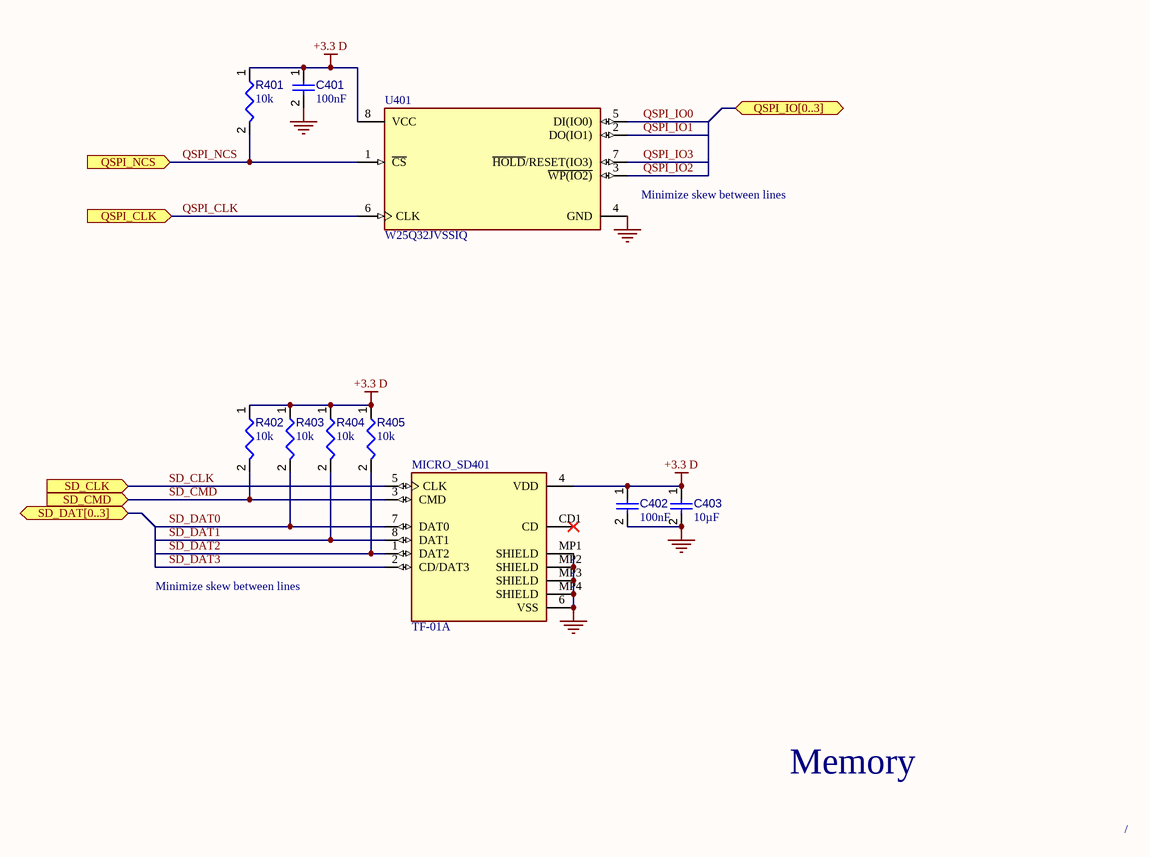
[diagram p4: 4 memory.SchDoc]

### Parts
C401  value 100nF  [CAPC0402(1005)60_L]  (hidden comment: Capacitor 100nF +/-20% 25V 0402)
C402  value 100nF  [CAPC0402(1005)60_L]  (hidden comment: Capacitor 100nF +/-20% 25V 0402)
C403  value 10µF  [CAPC0603(1608)100_L]  (hidden comment: Capacitor 10µF +/-20% 10V 0603)
MICRO_SD401  TF-01A  [TF-01A]
R401  value 10k  [RESC0402(1005)_L]  (hidden comment: Resistor 10K  +/-1 % 0402 63 mW)
R402  value 10k  [RESC0402(1005)_L]  (hidden comment: Resistor 10K  +/-1 % 0402 63 mW)
R403  value 10k  [RESC0402(1005)_L]  (hidden comment: Resistor 10K  +/-1 % 0402 63 mW)
R404  value 10k  [RESC0402(1005)_L]  (hidden comment: Resistor 10K  +/-1 % 0402 63 mW)
R405  value 10k  [RESC0402(1005)_L]  (hidden comment: Resistor 10K  +/-1 % 0402 63 mW)
U401  W25Q32JVSSIQ  [FP-SS-IPC_C]

### Ports
QSPI_CLK (in), QSPI_IO[0..3] (bidir), QSPI_NCS (in), SD_CLK (in), SD_CMD (in), SD_DAT[0..3] (bidir)

### Nets
+3.3 D: C401.1 C402.1 C403.1 MICRO_SD401.4(VDD) R401.1 R402.1 R403.1 R404.1 R405.1 U401.8(VCC)
GND: C401.2 C402.2 C403.2 MICRO_SD401.6(VSS) MICRO_SD401.MP1(SHIELD) MICRO_SD401.MP2(SHIELD) MICRO_SD401.MP3(SHIELD) MICRO_SD401.MP4(SHIELD) U401.4(GND)
QSPI_CLK: U401.6(CLK) ; port QSPI_CLK
QSPI_IO0: U401.5(DI(IO0))
QSPI_IO1: U401.2(DO(IO1))
QSPI_IO2: U401.3(~{WP(IO2)})
QSPI_IO3: U401.7(~{HOLD}/RESET(IO3))
QSPI_NCS: R401.2 U401.1(~{CS}) ; port QSPI_NCS
SD_CLK: MICRO_SD401.5(CLK) ; port SD_CLK
SD_CMD: MICRO_SD401.3(CMD) R402.2 ; port SD_CMD
SD_DAT0: MICRO_SD401.7(DAT0) R403.2
SD_DAT1: MICRO_SD401.8(DAT1) R404.2
SD_DAT2: MICRO_SD401.1(DAT2) R405.2
SD_DAT3: MICRO_SD401.2(CD/DAT3)

Not connected (* = marked no-connect by the designer): MICRO_SD401 CD1(CD)*

### Notes on the sheet
- (near U401) Minimize skew between lines
- Minimize skew between lines
- Memory
- /

### Library data of the parts
C401 C402 = CMP-001-00065-4: as C101 on sheet 1 power; Max Operating Temperature: 85°C; Min Operating Temperature: -55°C; Pins: 2; Voltage Rating: 25V; Mounting Technology: SMT; Case/Package: 0402
C403 = CMP-001-00075-4: as C110 on sheet 1 power; Voltage Rating: 10V; Max Operating Temperature: 85°C; Pins: 2; Case/Package: 0603; Mounting Technology: SMT; Min Operating Temperature: -55°C
MICRO_SD401 = TF-01A: Standard Card Edge Connectors; MF: HRO Electronics Co., Ltd.; Price: None; Availability: Not in stock; MP: TF-01A; Package: Package; SnapEDA_Link: https://www.snapeda.com/parts/TF-01A/HRO+Electronics+Co.%252C+Ltd./view-part/?ref=snap; Check_prices: https://www.snapeda.com/parts/TF-01A/HRO+Electronics+Co.%252C+Ltd./view-part/?ref=eda; Value: *
R401-R405 = CMP-009-00149-3: as R102 on sheet 1 power; Min Operating Temperature: -55°C; Case/Package: 0402; Max Operating Temperature: 155°C; Pins: 2
U401 = CMP-2000-05006-2: IC FLASH 32M SPI 104MHZ 8SOIC; Manufacturer: Winbond; Obsolete Part: true; Access Time: 7ns; Nominal Supply Current: 8-20mA; Memory Size: 32Mbits; Max Supply Voltage: 3.6V; Min Supply Voltage: 2.7V; Standoff Height: 0.05mm; Interface: SPI,Other; Package: SS; Memory Type: FLASH; Ipc Land Pattern Name: SOIC127P790X195-8; Temperature Range High: +85°C; Temperature: -40°C to +85°C; Octopart: https://octopart.com/w25q32fvssig-winbond-23896462; Manufacturer Part Number: W25Q32JVSSIQ; Ambient Temperature Range Low: -40°C; Lead Free: Yes; Height: 2.16mm; Automotive: No; Device Class L2: Memory; Digikey Description: IC FLASH 32M SPI 104MHZ 8SOIC; RoHS: TRUE; Frequency: 104MHz; Ambient Temperature Range High: +85°C; ComponentLink2Description: Datasheet; Category: IC; Device Class L1: Integrated Circuits (ICs); Device Class L3: Flash; Temperature Range Low: -40°C; Footprint Url: http://www.winbond.com/resource-files/an0000009%20spiflash%20pcb%20layout%20guideline%20v2.0%2009252017.pdf?__locale=en; ComponentLink2URL: https://www.winbond.com/resource-files/w25q32fv%20revj%2006032016.pdf

## Sheet 5 led.SchDoc
size A4; DocumentNumber: 5; SheetNumber: 7; SheetTotal: 9
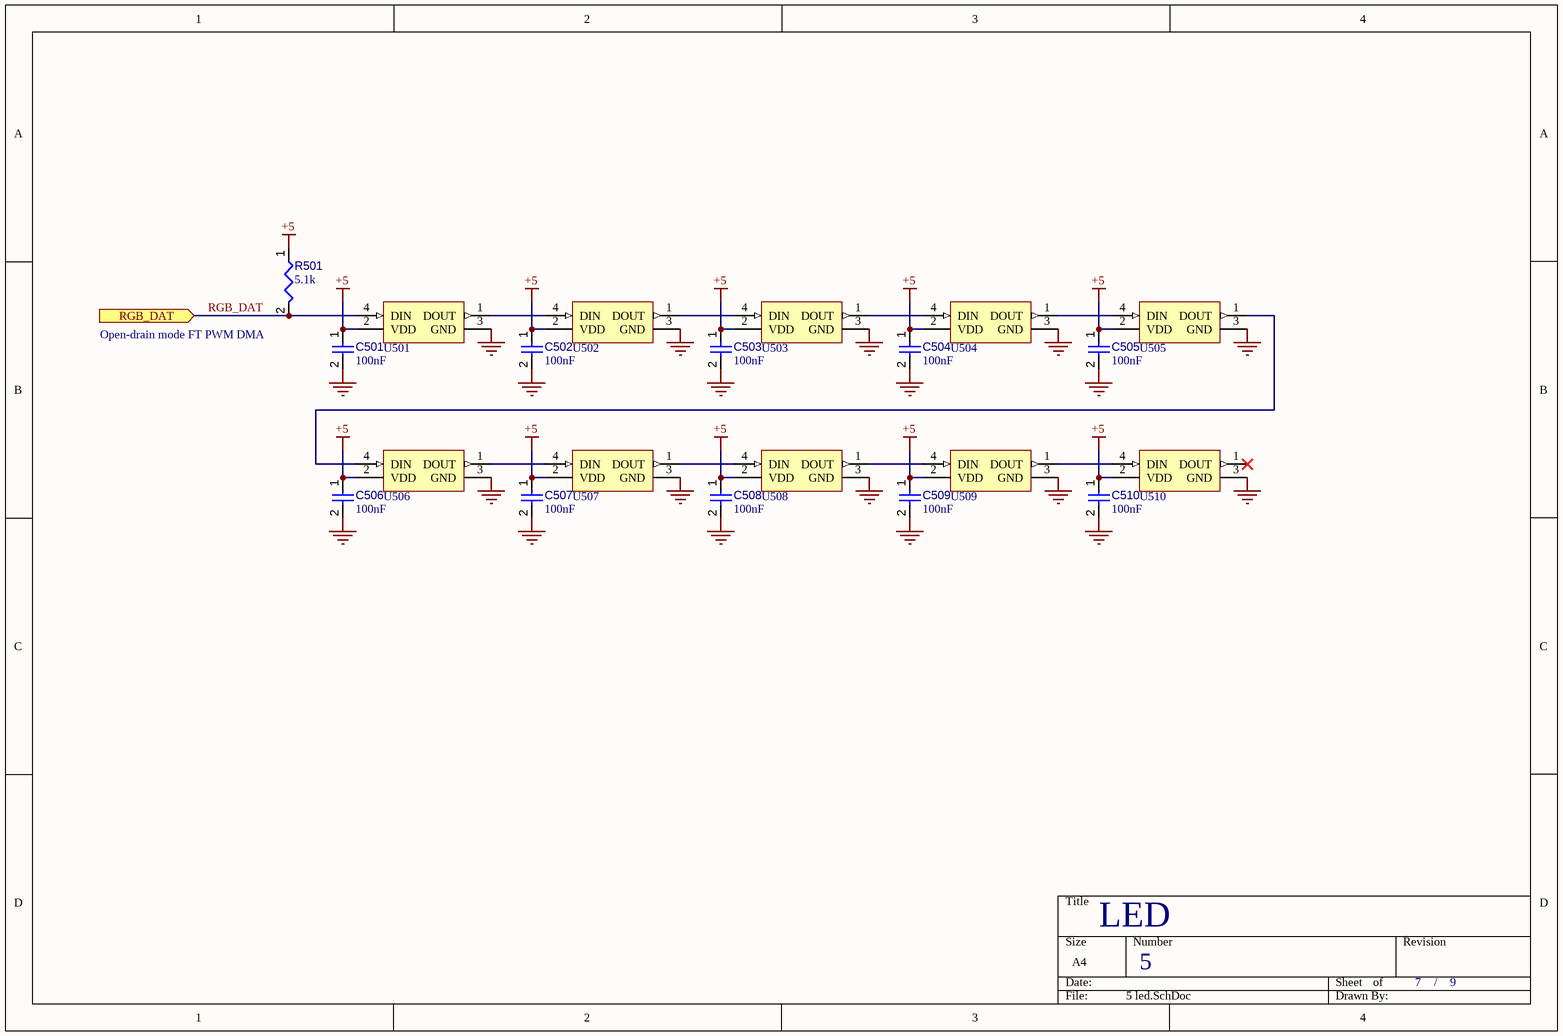
[diagram p5: 5 led.SchDoc]

### Parts
C501  value 100nF  [CAPC0402(1005)60_L]  (hidden comment: Capacitor 100nF +/-20% 25V 0402)
C502  value 100nF  [CAPC0402(1005)60_L]  (hidden comment: Capacitor 100nF +/-20% 25V 0402)
C503  value 100nF  [CAPC0402(1005)60_L]  (hidden comment: Capacitor 100nF +/-20% 25V 0402)
C504  value 100nF  [CAPC0402(1005)60_L]  (hidden comment: Capacitor 100nF +/-20% 25V 0402)
C505  value 100nF  [CAPC0402(1005)60_L]  (hidden comment: Capacitor 100nF +/-20% 25V 0402)
C506  value 100nF  [CAPC0402(1005)60_L]  (hidden comment: Capacitor 100nF +/-20% 25V 0402)
C507  value 100nF  [CAPC0402(1005)60_L]  (hidden comment: Capacitor 100nF +/-20% 25V 0402)
C508  value 100nF  [CAPC0402(1005)60_L]  (hidden comment: Capacitor 100nF +/-20% 25V 0402)
C509  value 100nF  [CAPC0402(1005)60_L]  (hidden comment: Capacitor 100nF +/-20% 25V 0402)
C510  value 100nF  [CAPC0402(1005)60_L]  (hidden comment: Capacitor 100nF +/-20% 25V 0402)
R501  value 5.1k  [RESC0402(1005)_L]  (hidden comment: Resistor 5K1  +/-1 % 0402 63 mW)
U501  WS2812B 1615  [WS2812B 1615]  (value not drawn)
U502  WS2812B 1615  [WS2812B 1615]  (value not drawn)
U503  WS2812B 1615  [WS2812B 1615]  (value not drawn)
U504  WS2812B 1615  [WS2812B 1615]  (value not drawn)
U505  WS2812B 1615  [WS2812B 1615]  (value not drawn)
U506  WS2812B 1615  [WS2812B 1615]  (value not drawn)
U507  WS2812B 1615  [WS2812B 1615]  (value not drawn)
U508  WS2812B 1615  [WS2812B 1615]  (value not drawn)
U509  WS2812B 1615  [WS2812B 1615]  (value not drawn)
U510  WS2812B 1615  [WS2812B 1615]  (value not drawn)

### Ports
RGB_DAT (in)

### Nets
+5: C501.1 C502.1 C503.1 C504.1 C505.1 C506.1 C507.1 C508.1 C509.1 C510.1 R501.1 U501.2(VDD) U502.2(VDD) U503.2(VDD) U504.2(VDD) U505.2(VDD) U506.2(VDD) U507.2(VDD) U508.2(VDD) U509.2(VDD) U510.2(VDD)
GND: C501.2 C502.2 C503.2 C504.2 C505.2 C506.2 C507.2 C508.2 C509.2 C510.2 U501.3(GND) U502.3(GND) U503.3(GND) U504.3(GND) U505.3(GND) U506.3(GND) U507.3(GND) U508.3(GND) U509.3(GND) U510.3(GND)
RGB_DAT: R501.2 U501.4(DIN) ; port RGB_DAT
NetU501_1: U501.1(DOUT) U502.4(DIN)
NetU502_1: U502.1(DOUT) U503.4(DIN)
NetU503_1: U503.1(DOUT) U504.4(DIN)
NetU504_1: U504.1(DOUT) U505.4(DIN)
NetU505_1: U505.1(DOUT) U506.4(DIN)
NetU506_1: U506.1(DOUT) U507.4(DIN)
NetU507_1: U507.1(DOUT) U508.4(DIN)
NetU508_1: U508.1(DOUT) U509.4(DIN)
NetU509_1: U509.1(DOUT) U510.4(DIN)

Not connected (* = marked no-connect by the designer): U510 1(DOUT)*

### Notes on the sheet
- (near R501) Open-drain mode FT PWM DMA
- LED
- /

### Library data of the parts
C501-C510 = CMP-001-00065-4: as C101 on sheet 1 power; Max Operating Temperature: 85°C; Min Operating Temperature: -55°C; Pins: 2; Voltage Rating: 25V; Mounting Technology: SMT; Case/Package: 0402
R501 = CMP-009-00158-3: as R301 on sheet 3 ports; Max Operating Temperature: 155°C; Pins: 2; Min Operating Temperature: -55°C; Case/Package: 0402

## Sheet 6 cell amplifier.SchDoc
size A4; DocumentNumber: 6; SheetNumber: 8; SheetTotal: 9
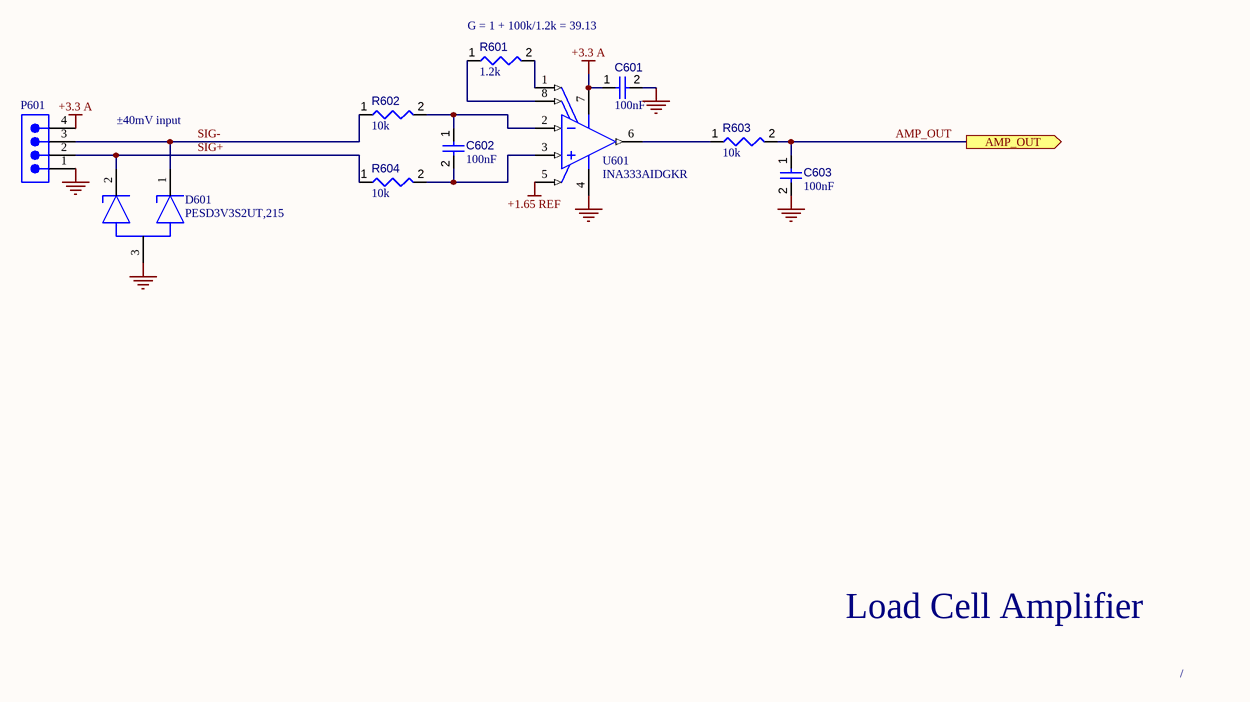
[diagram p6: 6 cell amplifier.SchDoc]

### Parts
C601  value 100nF  [CAPC0402(1005)60_L]  (hidden comment: Capacitor 100nF +/-20% 25V 0402)
C602  value 100nF  [CAPC0402(1005)60_L]  (hidden comment: Capacitor 100nF +/-20% 25V 0402)
C603  value 100nF  [CAPC0402(1005)60_L]  (hidden comment: Capacitor 100nF +/-20% 25V 0402)
D601  PESD3V3S2UT,215  [FP-SOT23-IPC_A]
P601  61300411121  [61300411121]  (value not drawn)
R601  value 1.2k  [RESC0402(1005)_L]  (hidden comment: Resistor 1K2 +/-1 % 0402 63 mW)
R602  value 10k  [RESC0402(1005)_L]  (hidden comment: Resistor 10K  +/-1 % 0402 63 mW)
R603  value 10k  [RESC0402(1005)_L]  (hidden comment: Resistor 10K  +/-1 % 0402 63 mW)
R604  value 10k  [RESC0402(1005)_L]  (hidden comment: Resistor 10K  +/-1 % 0402 63 mW)
U601  INA333AIDGKR  [DGK0008A_L]

### Ports
AMP_OUT (out)

### Nets
+1.65 REF: U601.5(REF)
+3.3 A: C601.1 P601.4 U601.7(V+)
GND: C601.2 C603.2 D601.3 P601.1 U601.4(V-)
AMP_OUT: C603.1 R603.2 ; port AMP_OUT
SIG+: D601.2 P601.2 R604.1
SIG-: D601.1 P601.3 R602.1
NetC602_1: C602.1 R602.2 U601.2(VIN-)
NetC602_2: C602.2 R604.2 U601.3(VIN+)
NetR601_1: R601.1 U601.8(RG)
NetR601_2: R601.2 U601.1(RG)
NetR603_1: R603.1 U601.6(VOUT)

### Notes on the sheet
- (near R601) G = 1 + 100k/1.2k = 39.13
- ±40mV input
- Load Cell Amplifier
- /

### Library data of the parts
C601-C603 = CMP-001-00065-4: as C101 on sheet 1 power; Max Operating Temperature: 85°C; Min Operating Temperature: -55°C; Pins: 2; Voltage Rating: 25V; Mounting Technology: SMT; Case/Package: 0402
D601 = CMP-14432-000008-1: TVS DIODE 3.3VWM 20VC TO236AB; RoHS Compliant: Yes
P601 = CMP-1502-01064-3: as P201 on sheet 2 main mcu; Contact Plating: Gold; Height: 8.89mm; Lead Pitch: 2.54mm; Lead Free: Lead Free; Contact Mating Length: 5.9944mm; Number of Rows: 1; Termination: Solder; Packaging: Bulk; REACH SVHC: Unknown; Min Operating Temperature: -40°C; RoHS: Compliant; Number of Contacts: 4; Voltage Rating: 250V; Color: Black; Max Operating Temperature: 105°C; Contact Material: Copper; Mount: Through Hole; Orientation: Vertical; Number of Pins: 4
R601 = CMP-009-00157-3: Chip Resistor, 1.2 kOhms, +/-1 %, 63 mW, -55 to 155 degC, 0402; Tolerance: 1%; Power: 63mW; Case/Package: 0402; Pins: 2; Min Operating Temperature: -55°C; Max Operating Temperature: 155°C
R602-R604 = CMP-009-00149-3: as R102 on sheet 1 power; Min Operating Temperature: -55°C; Case/Package: 0402; Max Operating Temperature: 155°C; Pins: 2
U601 = CMP-0944-00088-2: Low Power, Precision Instrumentation Amplifier, -40 to 125 degC, 8-pin SOP (DGK8), Green (RoHS & no Sb/Br); Manufacturer: Texas Instruments; Input Offset Drift (+/-)(Max)(uV/Degrees Celsius): 0.1; Vs(Max)(V): 5.5; Input Bias Current (+/-)(Max)(nA): 0.2; Output Offset (+/-)(Max)(uV): 75/G; CMRR(Min)(dB): 100; Noise at 1kHz(Typ)(nV/rt(Hz)): 50; Output Offset Drift (+/-)(Max)(uV/Degrees Celsius): 0.5/G; Vs(Min)(V): 1.8; Quiescent Current (+/-)(Typ)(mA): 0.05; Gain(V/V): 1 to 1000; SubFamily: Single Supply; Number of Channels: 1; Input Offset (+/-)(Max)(uV): 25; Code_JEDEC: MO-187; Eco-Plan: Green (RoHS & no Sb/Br); ComponentLink2URL: http://www.ti.com/general/docs/lit/getliterature.tsp?genericPartNumber=INA333&fileType=pdf; Mounting Technology: Surface Mount; PartNumber: INA333AIDGKR; ComponentLink3URL: http://www.ti.com/litv/pdf/mpds028d; ComponentLink1URL: http://www.ti.com/; DatasheetVersion: SBOS445B; ComponentLink2Description: Datasheet; PackageVersion: 4073329/E, 05/2006; PackageReference: DGK0008A; ComponentLink3Description: Package Specification; PackageDescription: 8-Pin Thin Small Outline, Body 3 x 3 mm, Pitch 0.65 mm; ComponentLink1Description: Manufacturer URL

## Sheet 7 esc.SchDoc
size A4; DocumentNumber: 7; SheetNumber: 9; SheetTotal: 9
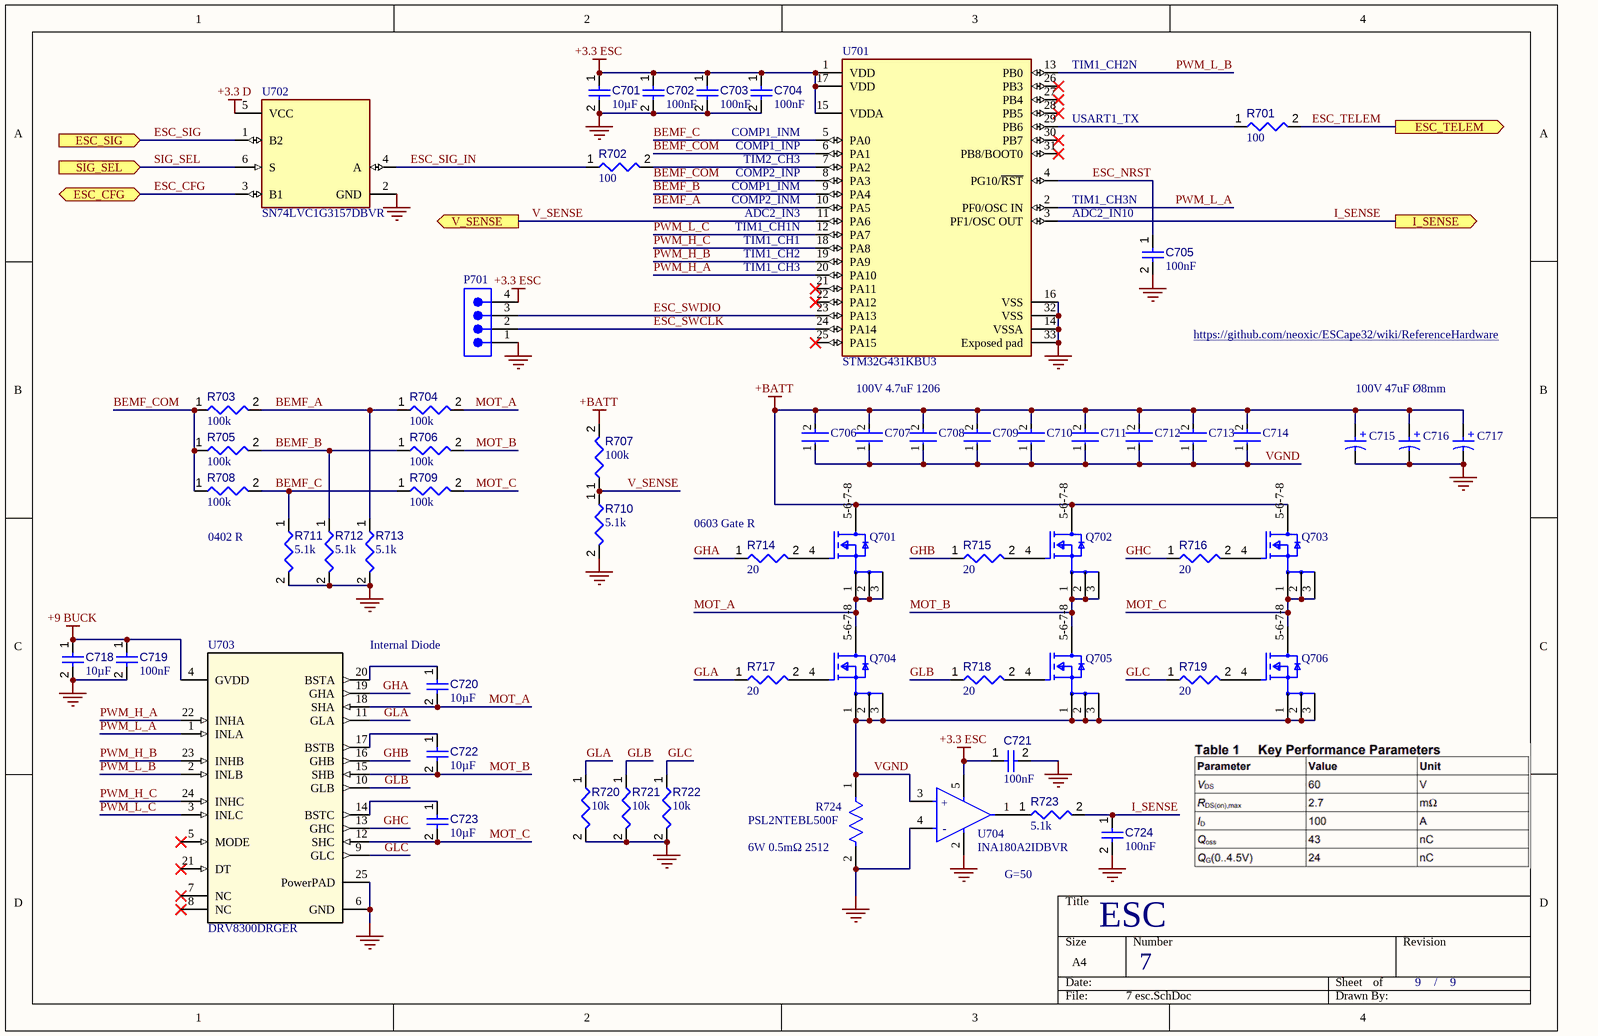
[diagram p7: 7 esc.SchDoc]

### Parts
C701  value 10µF  [CAPC0603(1608)100_L]  (hidden comment: Capacitor 10µF +/-20% 10V 0603)
C702  value 100nF  [CAPC0402(1005)60_L]  (hidden comment: Capacitor 100nF +/-20% 25V 0402)
C703  value 100nF  [CAPC0402(1005)60_L]  (hidden comment: Capacitor 100nF +/-20% 25V 0402)
C704  value 100nF  [CAPC0402(1005)60_L]  (hidden comment: Capacitor 100nF +/-20% 25V 0402)
C705  value 100nF  [CAPC0402(1005)60_L]  (hidden comment: Capacitor 100nF +/-20% 25V 0402)
C706  GRM31CZ72A475KE11L  [FP-GRM31C-0_3-e0_3_0_9-MFG]  (value not drawn)
C707  GRM31CZ72A475KE11L  [FP-GRM31C-0_3-e0_3_0_9-MFG]  (value not drawn)
C708  GRM31CZ72A475KE11L  [FP-GRM31C-0_3-e0_3_0_9-MFG]  (value not drawn)
C709  GRM31CZ72A475KE11L  [FP-GRM31C-0_3-e0_3_0_9-MFG]  (value not drawn)
C710  GRM31CZ72A475KE11L  [FP-GRM31C-0_3-e0_3_0_9-MFG]  (value not drawn)
C711  GRM31CZ72A475KE11L  [FP-GRM31C-0_3-e0_3_0_9-MFG]  (value not drawn)
C712  GRM31CZ72A475KE11L  [FP-GRM31C-0_3-e0_3_0_9-MFG]  (value not drawn)
C713  GRM31CZ72A475KE11L  [FP-GRM31C-0_3-e0_3_0_9-MFG]  (value not drawn)
C714  GRM31CZ72A475KE11L  [FP-GRM31C-0_3-e0_3_0_9-MFG]  (value not drawn)
C715  865230453006  [WCAP-AS5H_D8H10.5]  (value not drawn)
C716  865230453006  [WCAP-AS5H_D8H10.5]  (value not drawn)
C717  865230453006  [WCAP-AS5H_D8H10.5]  (value not drawn)
C718  value 10µF  [CAPC0603(1608)100_L]  (hidden comment: Capacitor 10µF +/-20% 10V 0603)
C719  value 100nF  [CAPC0402(1005)60_L]  (hidden comment: Capacitor 100nF +/-20% 25V 0402)
C720  value 10µF  [CAPC0603(1608)100_L]  (hidden comment: Capacitor 10µF +/-20% 10V 0603)
C721  value 100nF  [CAPC0402(1005)60_L]  (hidden comment: Capacitor 100nF +/-20% 25V 0402)
C722  value 10µF  [CAPC0603(1608)100_L]  (hidden comment: Capacitor 10µF +/-20% 10V 0603)
C723  value 10µF  [CAPC0603(1608)100_L]  (hidden comment: Capacitor 10µF +/-20% 10V 0603)
C724  value 100nF  [CAPC0402(1005)60_L]  (hidden comment: Capacitor 100nF +/-20% 25V 0402)
P701  61300411121  [61300411121]  (value not drawn)
Q701  BSC0702LSATMA1  [FP-PG-TDSON-8-MFG]  (value not drawn)
Q702  BSC0702LSATMA1  [FP-PG-TDSON-8-MFG]  (value not drawn)
Q703  BSC0702LSATMA1  [FP-PG-TDSON-8-MFG]  (value not drawn)
Q704  BSC0702LSATMA1  [FP-PG-TDSON-8-MFG]  (value not drawn)
Q705  BSC0702LSATMA1  [FP-PG-TDSON-8-MFG]  (value not drawn)
Q706  BSC0702LSATMA1  [FP-PG-TDSON-8-MFG]  (value not drawn)
R701  value 100  [RESC0402(1005)_L]  (hidden comment: Resistor 100R +/-1 % 0402 63 mW)
R702  value 100  [RESC0402(1005)_L]  (hidden comment: Resistor 100R +/-1 % 0402 63 mW)
R703  value 100k  [RESC0402(1005)_L]  (hidden comment: Resistor 100K +/-1 % 0402 63 mW)
R704  value 100k  [RESC0402(1005)_L]  (hidden comment: Resistor 100K +/-1 % 0402 63 mW)
R705  value 100k  [RESC0402(1005)_L]  (hidden comment: Resistor 100K +/-1 % 0402 63 mW)
R706  value 100k  [RESC0402(1005)_L]  (hidden comment: Resistor 100K +/-1 % 0402 63 mW)
R707  value 100k  [RESC0402(1005)_L]  (hidden comment: Resistor 100K +/-1 % 0402 63 mW)
R708  value 100k  [RESC0402(1005)_L]  (hidden comment: Resistor 100K +/-1 % 0402 63 mW)
R709  value 100k  [RESC0402(1005)_L]  (hidden comment: Resistor 100K +/-1 % 0402 63 mW)
R710  value 5.1k  [RESC0402(1005)_L]  (hidden comment: Resistor 5K1  +/-1 % 0402 63 mW)
R711  value 5.1k  [RESC0402(1005)_L]  (hidden comment: Resistor 5K1  +/-1 % 0402 63 mW)
R712  value 5.1k  [RESC0402(1005)_L]  (hidden comment: Resistor 5K1  +/-1 % 0402 63 mW)
R713  value 5.1k  [RESC0402(1005)_L]  (hidden comment: Resistor 5K1  +/-1 % 0402 63 mW)
R714  value 20  [RESC0603(1608)_L]  (hidden comment: Resistor 20R +/-5 % 0603 0.1 W)
R715  value 20  [RESC0603(1608)_L]  (hidden comment: Resistor 20R +/-5 % 0603 0.1 W)
R716  value 20  [RESC0603(1608)_L]  (hidden comment: Resistor 20R +/-5 % 0603 0.1 W)
R717  value 20  [RESC0603(1608)_L]  (hidden comment: Resistor 20R +/-5 % 0603 0.1 W)
R718  value 20  [RESC0603(1608)_L]  (hidden comment: Resistor 20R +/-5 % 0603 0.1 W)
R719  value 20  [RESC0603(1608)_L]  (hidden comment: Resistor 20R +/-5 % 0603 0.1 W)
R720  value 10k  [RESC0402(1005)_L]  (hidden comment: Resistor 10K  +/-1 % 0402 63 mW)
R721  value 10k  [RESC0402(1005)_L]  (hidden comment: Resistor 10K  +/-1 % 0402 63 mW)
R722  value 10k  [RESC0402(1005)_L]  (hidden comment: Resistor 10K  +/-1 % 0402 63 mW)
R723  value 5.1k  [RESC0402(1005)_L]  (hidden comment: Resistor 5K1  +/-1 % 0402 63 mW)
R724  PSL2NTEBL500F  [FP-PSL2NTEBL500F-MFG]
U701  STM32G431KBU3  [FP-UFQFPN32-A0B8-MFG]
U702  SN74LVC1G3157DBVR  [FP-DBV0006A-IPC_C]
U703  DRV8300DRGER  [RGE0024B-MFG]
U704  INA180A2IDBVR  [FP-DBV0005A-MFG]

### Ports
ESC_CFG (bidir), ESC_SIG (in), ESC_TELEM (out), I_SENSE (out), SIG_SEL (in), V_SENSE (out)

### Nets
+3.3 D: U702.5(VCC)
+3.3 ESC: C701.1 C702.1 C703.1 C704.1 C721.1 P701.4 U701.1(VDD) U701.15(VDDA) U701.17(VDD) U704.5(VS)
+9 BUCK: C718.1 C719.1 U703.4(GVDD)
+BATT: C706.2 C707.2 C708.2 C709.2 C710.2 C711.2 C712.2 C713.2 C714.2 C715.1(P) C716.1(P) C717.1(P) Q701.5-6-7-8(Drain) Q702.5-6-7-8(Drain) Q703.5-6-7-8(Drain) R707.2
GND: C701.2 C702.2 C703.2 C704.2 C705.2 C715.2(N) C716.2(N) C717.2(N) C718.2 C719.2 C721.2 C724.2 P701.1 R710.2 R711.2 R712.2 R713.2 R720.2 R721.2 R722.2 R724.2 U701.14(VSSA) U701.16(VSS) U701.32(VSS) U701.33(Exposed_pad) U702.2(GND) U703.6(GND) U703.25(PowerPAD) U704.2(GND) U704.4(IN-)
BEMF_A: R703.2 R704.1 R713.1 U701.10(PA5)
BEMF_B: R705.2 R706.1 R712.1 U701.9(PA4)
BEMF_C: R708.2 R709.1 R711.1 U701.5(PA0)
BEMF_COM: R703.1 R705.1 R708.1 U701.6(PA1) U701.8(PA3)
ESC_CFG: U702.3(B1) ; port ESC_CFG
ESC_NRST: C705.1 U701.4(PG10/~{RST})
ESC_SIG: U702.1(B2) ; port ESC_SIG
ESC_SIG_IN: R702.1 U702.4(A)
ESC_SWCLK: P701.2 U701.24(PA14)
ESC_SWDIO: P701.3 U701.23(PA13)
ESC_TELEM: R701.2 ; port ESC_TELEM
GHA: R714.1 U703.19(GHA)
GHB: R715.1 U703.16(GHB)
GHC: R716.1 U703.13(GHC)
GLA: R717.1 R720.1 U703.11(GLA)
GLB: R718.1 R721.1 U703.10(GLB)
GLC: R719.1 R722.1 U703.9(GLC)
I_SENSE: C724.1 R723.2 U701.3(PF1/OSC_OUT) ; port I_SENSE
MOT_A: C720.2 Q701.1(Source) Q701.2(Source) Q701.3(Source) Q704.5-6-7-8(Drain) R704.2 U703.18(SHA)
MOT_B: C722.2 Q702.1(Source) Q702.2(Source) Q702.3(Source) Q705.5-6-7-8(Drain) R706.2 U703.15(SHB)
MOT_C: C723.2 Q703.1(Source) Q703.2(Source) Q703.3(Source) Q706.5-6-7-8(Drain) R709.2 U703.12(SHC)
PWM_H_A: U701.20(PA10) U703.22(INHA)
PWM_H_B: U701.19(PA9) U703.23(INHB)
PWM_H_C: U701.18(PA8) U703.24(INHC)
PWM_L_A: U701.2(PF0/OSC_IN) U703.1(INLA)
PWM_L_B: U701.13(PB0) U703.2(INLB)
PWM_L_C: U701.12(PA7) U703.3(INLC)
SIG_SEL: U702.6(S) ; port SIG_SEL
V_SENSE: R707.1 R710.1 U701.11(PA6) ; port V_SENSE
VGND: C706.1 C707.1 C708.1 C709.1 C710.1 C711.1 C712.1 C713.1 C714.1 Q704.1(Source) Q704.2(Source) Q704.3(Source) Q705.1(Source) Q705.2(Source) Q705.3(Source) Q706.1(Source) Q706.2(Source) Q706.3(Source) R724.1 U704.3(IN+)
NetC720_1: C720.1 U703.20(BSTA)
NetC722_1: C722.1 U703.17(BSTB)
NetC723_1: C723.1 U703.14(BSTC)
NetQ701_4: Q701.4(Gate) R714.2
NetQ702_4: Q702.4(Gate) R715.2
NetQ703_4: Q703.4(Gate) R716.2
NetQ704_4: Q704.4(Gate) R717.2
NetQ705_4: Q705.4(Gate) R718.2
NetQ706_4: Q706.4(Gate) R719.2
NetR701_1: R701.1 U701.29(PB6)
NetR702_2: R702.2 U701.7(PA2)
NetR723_1: R723.1 U704.1(OUT)

Not connected (* = marked no-connect by the designer): U701 21(PA11)* 22(PA12)* 25(PA15)* 26(PB3)* 27(PB4)* 28(PB5)* 30(PB7)* 31(PB8/BOOT0)*; U703 5(MODE)* 7(NC)* 8(NC)* 21(DT)*

### Notes on the sheet
- (near U701) TIM1_CH2N
- COMP1_INM
- COMP1_INP
- TIM2_CH3
- (near U701) COMP2_INP
- (near U701) USART1_TX
- (near U701) TIM1_CH1N
- (near U701) TIM1_CH1
- (near U701) ADC2_IN3
- (near U701) COMP1_INM
- (near U701) COMP2_INM
- TIM1_CH3N
- ADC2_IN10
- (near U701) TIM1_CH2
- (near U701) TIM1_CH3
- https://github.com/neoxic/ESCape32/wiki/ReferenceHardware
- 100V 4.7uF 1206
- 100V 47uF Ø8mm
- 0402 R
- (near R714) 0603 Gate R
- Internal Diode
- (near R724) 6W 0.5mΩ 2512
- G=50
- ESC
- /
- (in symbol CMP-03913-53914685-1) +
- (in symbol CMP-04895-000287-1) +; -

### Library data of the parts
C701 C718 C720 C722 C723 = CMP-001-00075-4: as C110 on sheet 1 power; Voltage Rating: 10V; Max Operating Temperature: 85°C; Pins: 2; Case/Package: 0603; Mounting Technology: SMT; Min Operating Temperature: -55°C
C702-C705 C719 C721 C724 = CMP-001-00065-4: as C101 on sheet 1 power; Max Operating Temperature: 85°C; Min Operating Temperature: -55°C; Pins: 2; Voltage Rating: 25V; Mounting Technology: SMT; Case/Package: 0402
C706-C714 = CMP-06035-056253-1: as C102 on sheet 1 power
C715-C717 = CMP-03913-53914685-1: 865230453006 WCAP-AS5H Aluminum Electrolytic Capacitors; Voltage Rating: 25V; Ripple Current (AC): 116mA; Life (Hours): 5000hours; Polarity: Polar; Insulation Resistance: 1MΩ; Tolerance: 20%; Leakage Current: 25µA; Capacitance: 100µF; Mount: Surface Mount; Height - Seated (Max): 10.4902mm; NexarPartId: 53914685; RoHS: Compliant; Packaging: Digi-Reel®; Min Operating Temperature: -40°C; REACH SVHC: Unknown; Diameter: 8mm; Width: 8.3mm; Case/Package: Radial; Length: 10.5mm; Max Operating Temperature: 105°C; Voltage Rating (DC): 25V; Ripple Current: 116mA; Height: 10.5mm
P701 = CMP-1502-01064-3: as P201 on sheet 2 main mcu; Contact Plating: Gold; Height: 8.89mm; Lead Pitch: 2.54mm; Lead Free: Lead Free; Contact Mating Length: 5.9944mm; Number of Rows: 1; Termination: Solder; Packaging: Bulk; REACH SVHC: Unknown; Min Operating Temperature: -40°C; RoHS: Compliant; Number of Contacts: 4; Voltage Rating: 250V; Color: Black; Max Operating Temperature: 105°C; Contact Material: Copper; Mount: Through Hole; Orientation: Vertical; Number of Pins: 4
Q701-Q706 = CMP-00196-81703971-1: BSC0702LSATMA1 Transistor MOSFET N-CH 60V 100A 8-Pin TDSON T/R - Tape and Reel; Turn-Off Delay Time: 25ns; Max Junction Temperature (Tj): 150°C; Turn-On Delay Time: 7.7ns; Continuous Drain Current (ID): 23A; Number of Channels: 1; Power Dissipation: 2.5W; Gate to Source Voltage (Vgs): 20V; Drain to Source Resistance: 2.3mΩ; NexarPartId: 81703971; Drain to Source Breakdown Voltage: 60V; Max Operating Temperature: 150°C; Min Operating Temperature: -55°C; Drain to Source Voltage (Vdss): 60V; Height: 1mm
R701 R702 = CMP-009-00167-3: Chip Resistor, 100 Ohms, +/-1 %, 63 mW, -55 to 155 degC, 0402; Power: 63mW; Tolerance: 1%; Min Operating Temperature: -55°C; Case/Package: 0402; Pins: 2; Max Operating Temperature: 155°C
R703-R709 = CMP-009-00168-3: as R101 on sheet 1 power; Max Operating Temperature: 155°C; Min Operating Temperature: -55°C; Pins: 2; Case/Package: 0402
R710-R713 R723 = CMP-009-00158-3: as R301 on sheet 3 ports; Max Operating Temperature: 155°C; Pins: 2; Min Operating Temperature: -55°C; Case/Package: 0402
R714-R719 = CMP-009-00183-1: Chip Resistor, 20 Ohms, +/-5 %, 0.1 W, -55 to 155 degC, 0603; Tolerance: 5%; Power: 100mW; Pins: 2; Max Operating Temperature: 155°C; Case/Package: 0603; Min Operating Temperature: -55°C
R720-R722 = CMP-009-00149-3: as R102 on sheet 1 power; Min Operating Temperature: -55°C; Case/Package: 0402; Max Operating Temperature: 155°C; Pins: 2
R724 = CMP-04015-070281-1: RES 500 UOHM 1% 8W NONSTANDARD; RoHS Compliant: Yes
U701 = CMP-12105-000119-1: IC MCU 32BIT 128KB FLSH 32UFQFPN; RoHS Compliant: Yes
U702 = CMP-0859-00203-4: IC SWITCH SPDT SOT23-6; Number of Outputs: 2; Propagation Delay: 300ps; On-State Resistance: 15R; Nominal Supply Current: 10uA; Number of Inputs: 1; Max Supply Voltage: 5.5V; Supply Type: Single; Low Level Output Current: 128mA; Bandwidth: 300MHz; Turn-Off Delay Time: 3.8ns; Turn-On Delay Time: 5.7ns; Operating Supply Current: 1uA; Min Supply Voltage: 1.65V; Polarity: Non-Inverting; Height: 1.3mm; Number of Bits: 1; Case/Package: SOT-23; REACH SVHC: No SVHC; High Level Output Current: 128mA; Weight: 0.000229oz; Max Supply Current: 10uA; Width: 1.75mm; Radiation Hardening: No; Supply Current: 10uA; Length: 3.05mm; Max Operating Temperature: 125°C; Min Operating Temperature: -40°C; Package Quantity: 3000; Number of Pins: 6; Termination: SMD/SMT; Series: 74LVC; Packaging: Tape and Reel; Lead Free: Lead Free; Contact Plating: Gold; Mount: Surface Mount; RoHS Compliant: Yes; Number of Channels: 1; Throw Configuration: SPDT
U703 = DRV8300DRGER: No Description Available; Mfr_Name: Texas Instruments; TYPE: TYPE; RefDes: RefDes
U704 = CMP-04895-000287-1: IC CURR SENSE 1 CIRCUIT SOT23-5; Operating Supply Current: 260uA; -3db Bandwidth: 350kHz; Slew Rate: 2V/µs; Number of Circuits: 1; Input Offset Voltage (Vos): 100uV; Input Bias Current: 100nA; Mount: Surface Mount; Max Operating Temperature: 125°C; Packaging: Tape and Reel; Min Operating Temperature: -40°C; Case/Package: SOT-23-5; RoHS Compliant: Yes

## Nets that join several sheets
+1.65 REF: 1 power (U104.1 U104.4), 6 cell amplifier (U601.5)
+3.3 A: 1 power (6 pins), 2 main mcu (C209.1 C210.1 U201.20 U201.21), 6 cell amplifier (C601.1 P601.4 U601.7)
+3.3 D: 1 power (C116.1 C117.1 U103.2 U103.4), 2 main mcu (15 pins), 3 ports (C302.1 U301.7), 4 memory (10 pins), 7 esc (U702.5)
+3.3 ESC: 1 power (C126.1 C127.1 U106.3), 7 esc (10 pins)
+5: 1 power (C112.1 C113.1 U102.2 U102.4), 5 led (21 pins)
+9 BUCK: 1 power (17 pins), 7 esc (C718.1 C719.1 U703.4)
+BATT: 1 power (C102.2 C103.2 C104.2 U101.2), 7 esc (16 pins)
GND: 1 power (37 pins), 2 main mcu (25 pins), 3 ports (21 pins), 4 memory (9 pins), 5 led (20 pins), 6 cell amplifier (5 pins), 7 esc (30 pins)